# Altium project KC-1 FPGA Devboard.PrjPcb (part 1 of 2)
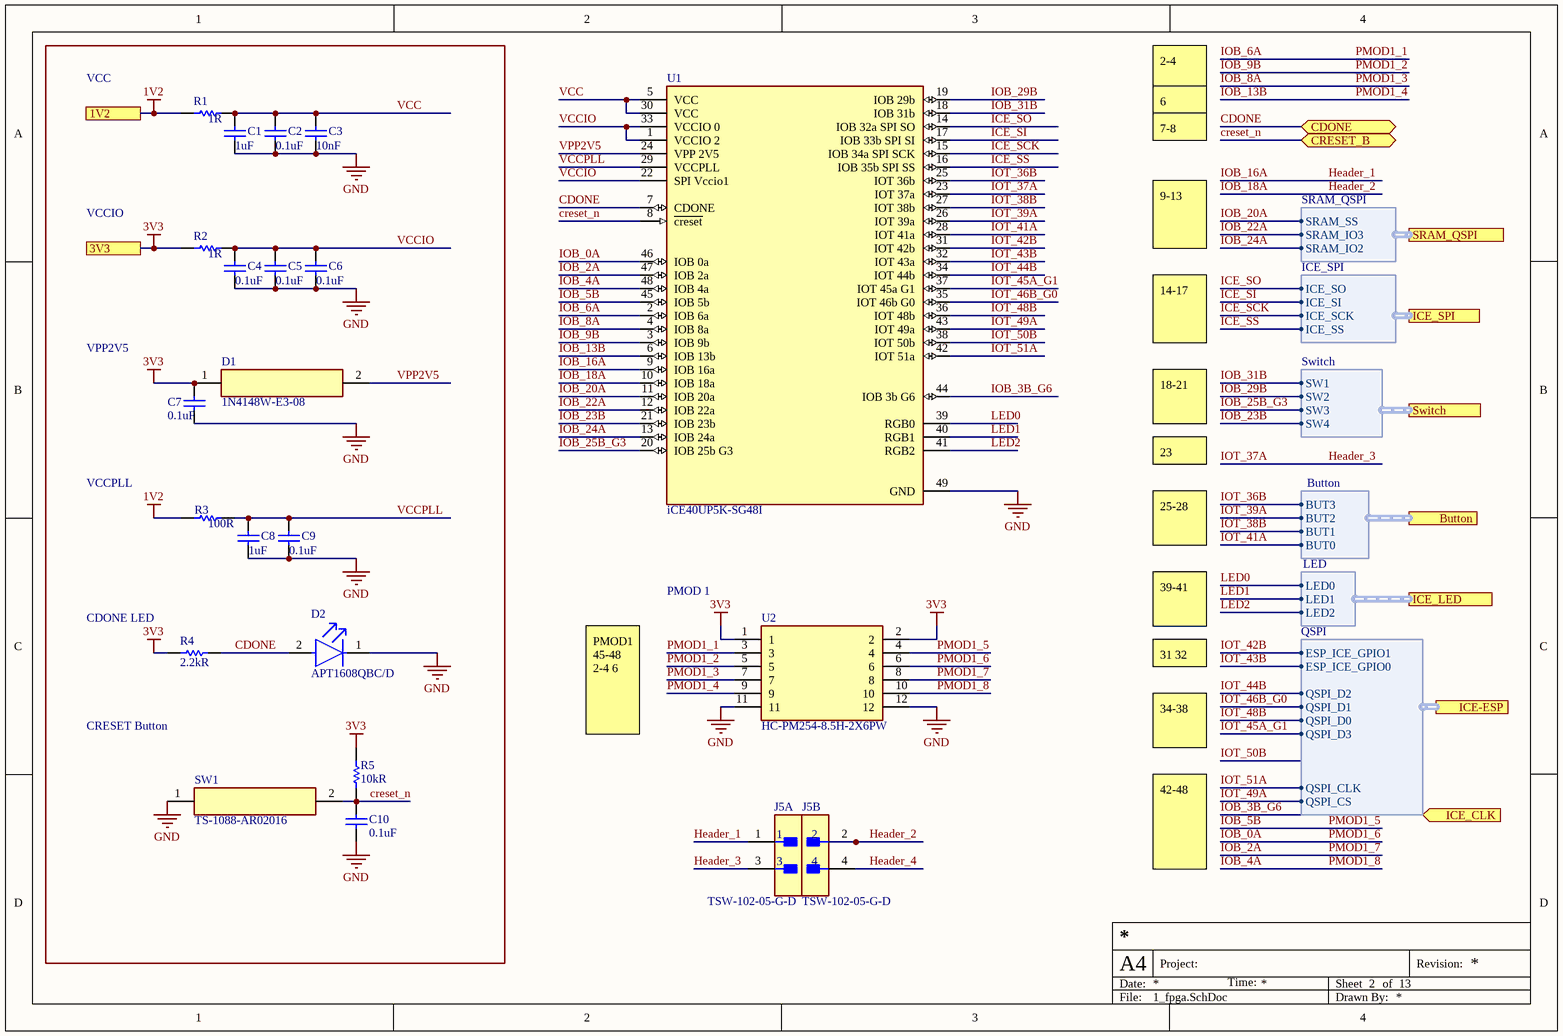
[diagram p0: 1_fpga.SchDoc]
CAGE_CODE: ?????; CONTRACT_NUMBER: <CONTRACT NO>; DOC_NO_ASSY_DWG: <ASSY DWG NO>; DOC_NO_BOM: <BOM DOC NO>; DOC_NO_FAB_DWG: <FAB DWG NO>; DOC_NO_SCH_DWG: <SCH DWG NO>; PCB_2_DEC_TOL: +/-.01; PCB_3_DEC_TOL: +/-.010; PCB_ANG_TOL: +/-1/2; PCB_ASSEMBLY_NO: <PCB ASSY NO>; PCB_CHECKER: - -----; PCB_CHECKER_APP_DATE: --/--/----; PCB_DESIGNER: - -----; PCB_DESIGNER_APP_DATE: --/--/----; PCB_DWG_NO: <PCB DWG NO>; PCB_ENGINEER: - -----; PCB_ENGINEER_APP_DATE: --/--/----; PCB_PART_NUMBER: <PCB PN>; PCB_REV: A; SCH_REV: A
12 sheets, 227 parts. Net scope: hierarchical (ports join the sheet entries above them; power ports are global).
Board file: PCB1.PcbDoc
Sheets:
  1_fpga.SchDoc
  2_power.SchDoc
  3_IO.SchDoc
  4_esp32.SchDoc
  5_FTDI.SchDoc
  6_FPGA_Flash.SchDoc
  7_SD_slot.SchDoc
  8_Lights.SchDoc
  9_ESP32_GPIO_header.SchDoc
  10_microphone.SchDoc
  12_PSRAM.SchDoc
  11_ethernet.SchDoc

## Sheet 1_fpga.SchDoc
size A4; SheetNumber: 2; SheetTotal: 13

### Parts
C1  1uF  [CAPC1609X100X15NL20]
C2  0.1uF  [CAPC1609X100X15NL20]
C3  10nF  [CAPC1609X100X15NL20]
C4  0.1uF  [CAPC1609X100X15NL20]
C5  0.1uF  [CAPC1609X100X15NL20]
C6  0.1uF  [CAPC1609X100X15NL20]
C7  0.1uF  [CAPC1609X100X15NL20]
C8  1uF  [CAPC1609X100X15NL20]
C9  0.1uF  [CAPC1609X100X15NL20]
C10  0.1uF  [CAPC1609X100X15NL20]
D1  1N4148W-E3-08  [SOD-123_L2.8-W1.8-LS3.7-RD]
D2  APT1608QBC/D  [FP-APT1608QBC-D-MFG]
J5  TSW-102-05-G-D  [FP-TSW-102-05-G-D-MFG]  (parts A,B of 2)
R1  1R  [RESC1609X55X30NL10T20]
R2  1R  [RESC1609X55X30NL10T20]
R3  100R  [RESC1609X55X30NL10T20]
R4  2.2kR  [RESC1609X55X30NL10T20]
R5  10kR  [RESC1609X55X30NL10T20]
SW1  TS-1088-AR02016  [SW-SMD_L3.9-W3.0-P4.45]
U1  iCE40UP5K-SG48I  [FP-QFN-48-IPC_C]
U2  HC-PM254-8.5H-2X6PW  [CONN-TH_HC-PM254-8.5H-2X6PW]

### Ports
1V2, 3V3, Button (harness Button), CDONE (bidir), CRESET_B (bidir), ICE-ESP (harness QSPI), ICE_CLK (in), ICE_LED (harness LED), ICE_SPI (harness ICE_SPI), SRAM_QSPI (harness SRAM_QSPI), Switch (harness Switch)

### Harnesses
Switch: SW1, SW2, SW3, SW4
Button: BUT0, BUT2, BUT3, BUT1
ICE_SPI: ICE_SO, ICE_SI, ICE_SCK, ICE_SS
SRAM_QSPI: SRAM_IO3, SRAM_IO2, SRAM_SS
QSPI: QSPI_D3, QSPI_CS, QSPI_CLK, QSPI_D1, QSPI_D2, QSPI_D0, ESP_ICE_GPIO0, ESP_ICE_GPIO1
LED: LED2, LED0, LED1

### Nets
1V2: R1.1 R3.1 ; port 1V2
3V3: C7.2 D1.1(K) R2.1 R4.2 R5.1 U2.1 U2.2 ; port 3V3
GND: C1.1 C2.1 C3.1 C4.1 C5.1 C6.1 C7.1 C8.1 C9.1 C10.2 D2.1(C) SW1.1 U1.49(GND) U2.11 U2.12
CDONE: D2.2(A) R4.1 U1.7(CDONE) ; port CDONE
creset_n: C10.1 R5.2 SW1.2 U1.8(~{creset}) ; port CRESET_B
Header_1: J5.1 U1.9(IOB_16a)  [also labelled IOB_16A]
Header_2: J5.2 U1.10(IOB_18a)  [also labelled IOB_18A]
Header_3: J5.3 U1.23(IOT_37a)  [also labelled IOT_37A]
Header_4: J5.4 U1.38(IOT_50b)  [also labelled IOT_50B]
ICE_SCK: U1.15(IOB_34a_SPI_SCK) ; port ICE_SPI.ICE_SCK
ICE_SI: U1.17(IOB_33b_SPI_SI) ; port ICE_SPI.ICE_SI
ICE_SO: U1.14(IOB_32a_SPI_SO) ; port ICE_SPI.ICE_SO
ICE_SS: U1.16(IOB_35b_SPI_SS) ; port ICE_SPI.ICE_SS
IOB_0A: U1.46(IOB_0a) U2.6  [also labelled PMOD1_6]
IOB_2A: U1.47(IOB_2a) U2.8  [also labelled PMOD1_7]
IOB_3B_G6: U1.44(IOB_3b_G6) ; port ICE_CLK
IOB_4A: U1.48(IOB_4a) U2.10  [also labelled PMOD1_8]
IOB_5B: U1.45(IOB_5b) U2.4  [also labelled PMOD1_5]
IOB_6A: U1.2(IOB_6a) U2.3  [also labelled PMOD1_1]
IOB_8A: U1.4(IOB_8a) U2.7  [also labelled PMOD1_3]
IOB_9B: U1.3(IOB_9b) U2.5  [also labelled PMOD1_2]
IOB_13B: U1.6(IOB_13b) U2.9  [also labelled PMOD1_4]
IOB_20A: U1.11(IOB_20a) ; port SRAM_QSPI.SRAM_SS
IOB_22A: U1.12(IOB_22a) ; port SRAM_QSPI.SRAM_IO3
IOB_23B: U1.21(IOB_23b) ; port Switch.SW4
IOB_24A: U1.13(IOB_24a) ; port SRAM_QSPI.SRAM_IO2
IOB_25B_G3: U1.20(IOB_25b_G3) ; port Switch.SW3
IOB_29B: U1.19(IOB_29b) ; port Switch.SW2
IOB_31B: U1.18(IOB_31b) ; port Switch.SW1
IOT_36B: U1.25(IOT_36b) ; port Button.BUT3
IOT_38B: U1.27(IOT_38b) ; port Button.BUT1
IOT_39A: U1.26(IOT_39a) ; port Button.BUT2
IOT_41A: U1.28(IOT_41a) ; port Button.BUT0
IOT_42B: U1.31(IOT_42b) ; port ICE-ESP.ESP_ICE_GPIO1
IOT_43B: U1.32(IOT_43a) ; port ICE-ESP.ESP_ICE_GPIO0
IOT_44B: U1.34(IOT_44b) ; port ICE-ESP.QSPI_D2
IOT_45A_G1: U1.37(IOT_45a_G1) ; port ICE-ESP.QSPI_D3
IOT_46B_G0: U1.35(IOT_46b_G0) ; port ICE-ESP.QSPI_D1
IOT_48B: U1.36(IOT_48b) ; port ICE-ESP.QSPI_D0
IOT_49A: U1.43(IOT_49a) ; port ICE-ESP.QSPI_CS
IOT_51A: U1.42(IOT_51a) ; port ICE-ESP.QSPI_CLK
LED0: U1.39(RGB0) ; port ICE_LED.LED0
LED1: U1.40(RGB1) ; port ICE_LED.LED1
LED2: U1.41(RGB2) ; port ICE_LED.LED2
VCC: C1.2 C2.2 C3.2 R1.2 U1.5(VCC) U1.30(VCC)
VCCIO: C4.2 C5.2 C6.2 R2.2 U1.1(VCCIO_2) U1.22(SPI_Vccio1) U1.33(VCCIO_0)
VCCPLL: C8.2 C9.2 R3.2 U1.29(VCCPLL)
VPP2V5: D1.2(A) U1.24(VPP_2V5)

### Notes on the sheet
- VCC
- 2-4
- 6
- 7-8
- VCCIO
- 9-13
- VPP2V5
- 14-17
- 18-21
- VCCPLL
- 23
- 25-28
- (near R4) CDONE LED
- PMOD 1
- 39-41
- 31 32
- CRESET Button
- PMOD1
  45-48
  2-4 6
- 34-38
- 42-48
- Date:
- A4
- Project:
- Time:
- Sheet
- of
- Revision:
- File:
- Drawn By:

### Library data of the parts
C1-C10 = CMP-2006-00183-1: Manufacturer: AVX Interconnect / Elco; Part Number: TACL105K006XTA
D1 = CMP-004-00031-1: Diode Configuration:1 Independent Pd - Power Dissipation:350mW Current - Rectified:150mA Voltage - DC Reverse(Vr):75V Voltage - Forward(Vf@If):1.2V@100mA Non-Repetitive Peak Forward Surge Current:2A Reverse Leakage Current (Ir):100uA@100V Reverse Recovery; Manufacturer: VISHAY(威世); Current - Rectified: 150mA; Reverse Recovery Time (trr): 4ns; Operating Junction Temperature Range: -55℃~+150℃; Voltage - DC Reverse(Vr): 75V; Pd - Power Dissipation: 350mW; Non-Repetitive Peak Forward Surge Current: 2A; LCSC Part Name: 75V 150mA; Manufacturer Part: 1N4148W-E3-08; Diode Configuration: 1 Independent; Supplier Footprint: SOD-123; Datasheet: https://item.szlcsc.com/datasheet/1N4148W-E3-08/240783.html; Reverse Leakage Current (Ir): 100uA@100V; Voltage - Forward(Vf@If): 1.2V@100mA; Supplier Part: C241939; Design Item ID: 1N4148W-E3-08; Source: EasyEDA.schlib; JLCPCB Part Class: Extended Part
D2 = CMP-2000-05788-2: LED BLUE CLEAR CHIP SMD; Lens Style: Flat; Forward Current: 20mA; Luminous Intensity: 100mcd; Number of LEDs: 1; Dominant Wavelength: 465nm; Lens Color: Colorless; Forward Voltage: 3.3V; Viewing Angle: 120°; Case Code (Imperial): 0603; Number of Pins: 2; Length: 1.6mm; Mount: Surface Mount; Color: Blue; Width: 0.8mm; Height: 0.75mm; Case/Package: 0603; Lead Free: Lead Free; Case Code (Metric): 1608; Lens Transparency: Clear; Min Operating Temperature: -40°C; Packaging: Tape and Reel; Max Operating Temperature: 85°C; Package Quantity: 2000; Test Current: 20mA; Illumination Color: Blue
J5 = CMP-02766-001389-1: CONN HEADER VERT 4POS 2.54MM; Max Voltage Rating (AC): 550V; Connector Type: Male Pin; Row Spacing: 0.1inch; Max Current Rating: 7.6A; Number of Positions: 4; Gender: Male; Packaging: Bulk; Color: Black; Housing Material: Plastic; Contact Material: Bronze; Contact Plating: Gold; Housing Color: Black; Width: 5.08mm; Orientation: Straight; Pitch: 2.54mm; Lead Free: Lead Free; Series: TSW; Min Operating Temperature: -55°C; Contact Type: Male Pin; Height: 2.54mm; Termination: Solder; Number of Rows: 2; Contact Mating Length: 0.105inch; Package Quantity: 1; Length: 5.08mm; REACH SVHC: No SVHC; Mount: Through Hole; Radiation Hardening: No; Number of Contacts: 4; Max Operating Temperature: 125°C
R1-R5 = CMP-2000-03692-1: Manufacturer: Vishay Dale; Part Number: TNPW060310K0BEEN
SW1 = TS-1088-AR02016: Circuit:SPST Actuator Style:Round Button Operating Force:1.6N Mounting Type:Surface Mount,Vertical Length:3.9mm Width:3mm Switch Height:2mm with Bracket:Without Bracket Contact Current:50mA Voltage Rating:12V Actuator/Cap Color:Black With Lamp:- IP Rating; Manufacturer: XUNPU(讯普); Circuit: SPST; Operating Force: 1.6N; Switch Height: 2mm; Contact Current: 50mA; Voltage Rating: 12V; Actuator/Cap Color: Black; Life: 100,000 cycles; LCSC Part Name: 3.9*3*2mm 立贴 轻触开关; Supplier Part: C720477; Manufacturer Part: TS-1088-AR02016; Supplier Footprint: SMD,4x3mm; JLCPCB Part Class: Basic Part; Datasheet: https://item.szlcsc.com/datasheet/TS-1088-AR02016/763484.html; Supplier: LCSC; Actuator Style: Round Button; Mounting Type: Surface Mount,Vertical; Length: 3.9mm; Width: 3mm; with Bracket: Without Bracket; Termination Style: SMD(SMT) Tab; Operating Temperature: -30℃~+80℃
U1 = CMP-17932-000001-1: ICE40-ULTRAPLUS, 5280 LUTS, 1.2V; Manufacturer: Lattice; Propagation Delay: 9ns; Frequency: 48MHz; Max Junction Temp: +100°C; Ram Size: 1024Kbits; Number Of Logic Elements Cells: 5280; Number Of I/Os: 39; Max Supply Voltage: 3.46V; Standoff Height: 0mm; Nominal Supply Current: 2.5-12mA; Min Supply Voltage: 1.14V; Number Of Logic Blocks: 660; Device Class L3: FPGAs - Field Programmable Gate Arrays; Temperature Range High: +100°C; Device Class L1: Integrated Circuits (ICs); Device Class L2: Embedded Processors and Controllers; Ipc Land Pattern Name: QFN50P700X700X90-48; Automotive: No; RoHS: TRUE; Lead Free: Yes; Height: 1mm; ComponentLink2Description: Datasheet; Manufacturer Part Number: iCE40UP5K-SG48I; Temperature Range Low: -40°C; Package: QFN-48; Temperature: -40°C to +100°C; Octopart: https://octopart.com/ice40up5k-sg48i-lattice+semiconductor-87369311; Footprint Url: http://www.latticesemi.com/view_document?document_id=213; Digikey Description: ICE40-ULTRAPLUS, 5280 LUTS, 1.2V; ComponentLink2URL: http://www.latticesemi.com/view_document?document_id=51968; Category: IC
U2 = HC-PM254-8.5H-2X6PW: Holes Structure:2x6P Pitch:2.54mm Row Spacing:2.54mm Circular Hole / Square Hole:Square Hole Mounting Type:Right Angle Number of Rows:2 Number of Positions:12P Current Rating:3A Voltage Rating (Max):- Holes Direction:Side Insulation Height:5mm Contact Mat; Manufacturer: HC(虹成电子); Holes Structure: 2x6P; Pitch: 2.54mm; Number of Positions: 12P; Current Rating: 3A; Holes Direction: Side; PIN Length: 3mm; LCSC Part Name: 间距2.54mm 2x6Pin 弯插 PC3.2 PB12.7 H8.5; Supplier Part: C22373932; Manufacturer Part: HC-PM254-8.5H-2x6PW; Supplier Footprint: 弯插,P=2.54mm; JLCPCB Part Class: Extended Part; Datasheet: https://item.szlcsc.com/datasheet/HC-PM254-8.5H-2x6PW/23870269.html; Supplier: LCSC; Row Spacing: 2.54mm; Circular Hole / Square Hole: Square Hole; Mounting Type: Right Angle; Number of Rows: 2; Insulation Height: 5mm; Contact Material: Brass; Contact Plating: Gold; Operating Temperature: -40℃~+105℃

## Sheet 2_power.SchDoc
size A4; SheetNumber: 3; SheetTotal: 13
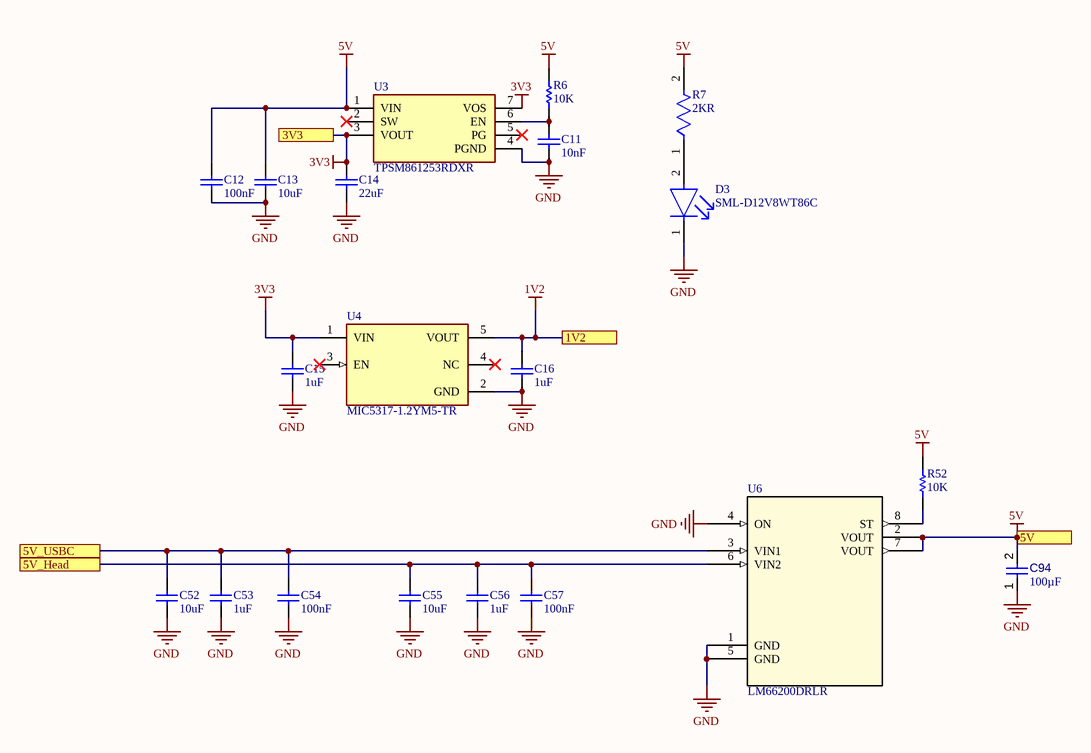
[diagram p1: 2_power.SchDoc]

### Parts
C11  10nF  [CAPC1608X90X35ML15T15]
C12  100nF  [CAPC1608X90X35ML15T15]
C13  10uF  [CAPC1608X90X35ML15T15]
C14  22uF  [CAPC1608X90X35ML15T15]
C15  1uF  [CAPC1608X90X35LL15T15]
C16  1uF  [CAPC1608X90X35LL15T15]
C52  10uF  [CAPC1608X90X35ML15T15]
C53  1uF  [CAPC1608X90X35LL15T15]
C54  100nF  [CAPC1608X90X35ML15T15]
C55  10uF  [CAPC1608X90X35ML15T15]
C56  1uF  [CAPC1608X90X35LL15T15]
C57  100nF  [CAPC1608X90X35ML15T15]
C94  value 100µF  [CAPC0805(2012)145_L]  (hidden comment: Capacitor 100µF +/-20% 6.3V 0805)
D3  SML-D12V8WT86C  [FP-SML-D12-MFG]
R6  10K  [RESC1609X55X30NL10T20]
R7  2KR  [FP-CPF0603-MFG]
R52  10K  [RESC1609X55X30NL10T20]
U3  TPSM861253RDXR  [QFN-7_L4.0-W3.3_TPSM863257RDXR]
U4  MIC5317-1.2YM5-TR  [FP-SOT23-5LD-PL-1-MFG]
U6  LM66200DRLR  [SOT-5X3_DRL_TEX]

### Ports
1V2, 3V3, 5V, 5V_Head, 5V_USBC

### Nets
1V2: C16.2 U4.5(VOUT) ; port 1V2
3V3: C14.2 C15.2 U3.3(VOUT) U3.7(VOS) U4.1(VIN) ; port 3V3
5V: C12.2 C13.2 C94.2 R6.2 R7.2 R52.2 U3.1(VIN) U6.2(VOUT) U6.7(VOUT) ; port 5V
GND: C11.1 C12.1 C13.1 C14.1 C15.1 C16.1 C52.1 C53.1 C54.1 C55.1 C56.1 C57.1 C94.1 D3.1(C) U3.4(PGND) U4.2(GND) U6.1(GND) U6.4(ON) U6.5(GND)
NetC11_2: C11.2 R6.1 U3.6(EN)
NetC52_2: C52.2 C53.2 C54.2 U6.3(VIN1) ; port 5V_USBC
NetC55_2: C55.2 C56.2 C57.2 U6.6(VIN2) ; port 5V_Head
NetD3_2: D3.2(A) R7.1
NetR52_1: R52.1 U6.8(ST)

Not connected (* = marked no-connect by the designer): U3 2(SW)* 5(PG)*; U4 3(EN)* 4(NC)*

### Notes on the sheet
- Date:
- A4
- Project:
- Time:
- Sheet
- of
- Revision:
- File:
- Drawn By:

### Library data of the parts
C11-C14 C52 C54 C55 C57 = CMP-2006-04205-1: Manufacturer: AVX Interconnect / Elco; Part Number: 06034D226MAT2A
C15 C16 C53 C56 = CMP-2006-02241-1: Part Number: C0603C105K9PACTU; Manufacturer: Kemet
C94 = CMP-001-00054-4: Chip Capacitor, 100µF +/-20%, 6.3V, 0805, Thickness 1.45 mm; Tolerance: 10%; Min Operating Temperature: -55°C; Max Operating Temperature: 85°C; Pins: 2; Mounting Technology: SMT; Case/Package: 0805; Voltage Rating: 6.3V
D3 = CMP-08952-000027-1: LED RED 1608 SMD; Forward Voltage: 2.2V; Luminous Intensity: 40mcd; Lens Size: 0.8mm; Lens Style: Flat; Lens Color: White; Test Current: 20mA; Dominant Wavelength: 630nm; Height: 0.65mm; Length: 1.6mm; Case Code (Metric): 1608; Color: Red; Mount: Surface Mount; Width: 0.8mm; Case Code (Imperial): 0603; Case/Package: 0603; Packaging: Tape and Reel
R6 R52 = CMP-2000-03692-1: as R1 on sheet 1_fpga
R7 = CMP-03211-009149-1: RES SMD 2.0KΩ 1% 1/16W 0603; Manufacturer: TE Connectivity; Manufacturer Part Number: CPF0603F2K0C1; Power Rating: 0.063W; Temperature Coefficient: 50ppm/°C; Voltage Rating: 50V; Temperature Range High: +155°C; Category: Res; Octopart: https://octopart.com/cpf0603f2k0c1-te+connectivity-7514873; ComponentLink2URL: https://www.te.com/commerce/DocumentDelivery/DDEController?Action=showdoc&DocId=Data+Sheet%7F1773200%7FM%7Fpdf%7FEnglish%7FENG_DS_1773200_M.pdf%7F3-1676481-2; Device Class L3: Chip SMD Resistors; Temperature Range Low: -55°C; Automotive: No; Lead Free: Yes; Device Class L2: Resistors; Device Class L1: Passive Components; Resistance: 2.0KΩ; octopart_url: https://octopart.com/cpf0603f2k0c1-te+connectivity-7514873; packaging: 1k Reel; Composition: Thin Film; ComponentLink2Description: Datasheet; Temperature: -55°C to +155°C; Package: CPF0603; RoHS: TRUE; Ipc Land Pattern Name: RESC15580X45; Tolerance: 1%; Value: 2.0KΩ; Height: 0.55mm; Series: CPF
U3 = TPSM861253RDXR: Function:Step-down type Number of Outputs:1 Voltage - Supply:3V~17V Voltage - Supply:3V~17V Conversion Efficiency:- Conversion Efficiency:- Output Voltage:3.3V Output Voltage:3.3V Output Voltage Accuracy:±1% Output Voltage Accuracy:±1% Output Current(Max); Manufacturer: TI(德州仪器); Number of Outputs: 1; Voltage - Supply: 3V~17V; Output Voltage: 3.3V; Output Voltage Accuracy: ±1%; Output Current(Max): 1A; Quiescent Supply Current: 370uA; Ripple Noise: 20mVp-p; Switching Frequency: 1.4MHz; LCSC Part Name: 3V至17V输入、1A同步降压模块; Supplier Part: C31183817; Manufacturer Part: TPSM861253RDXR; Supplier Footprint: QFN-FCMOD-7(3.3x4); JLCPCB Part Class: Extended Part; Datasheet: https://www.ti.com.cn/cn/lit/ds/symlink/tpsm861252.pdf?ts=1729502160167&ref_url=https%253A%252F%252Fwww.ti.com.cn%252Fsitesearch%252Fzh-cn%252Fdocs%252Funiversalsearch.tsp%253FlangPref%253Dzh-CN%2526nr%253D9%2526searchTerm%253DTPSM861252RDXR; Supplier: LCSC; Function: Step-down type; Operating Temperature Range: -40℃~+125℃; Length: 4mm; Width: 3.3mm; Height: 2mm; Features: Overvoltage protection；Over-temperature protection；Over Current Protection；Under Voltage Protection；Automatic fault recovery
U4 = CMP-00252-66802792-1: MIC5317-1.8YM5-TR LDO Regulator Pos 1.8V 0.15A 5-Pin SOT-23 T/R; Number of Outputs: 1; Dropout Voltage: 155mV; Power Supply Rejection Ratio (PSRR): 70dB; Max Input Voltage: 6V; Min Input Voltage: 2.5V; Output Current: 150mA; Min Current Limit: 200mA; Schedule B: 8542390000, 8542390000; Min Operating Temperature: -40°C; Lifecycle Status: Production; NexarPartId: 66802792; Mount: Surface Mount; Output Voltage: 1.8V; Number of Regulators: 1; RoHS: Compliant; Case/Package: SOT-23-5; Max Operating Temperature: 125°C
U6 = CMP-005-000000-1: 1.6-V to 5.5-V, 40-mâ„; Manufacturer_Name: Texas Instruments; Manufacturer_Part_Number: LM66200DRLR; Pin Count: 8; Source: LM66200DRLR.SchLib; Type: Type; Component Type: Standard; Design Item ID: LM66200DRLR; Copyright: Copyright (C) 2025 Ultra Librarian. All rights reserved.; RefDes: RefDes

## Sheet 3_IO.SchDoc
size A3; SheetNumber: 4; SheetTotal: 13
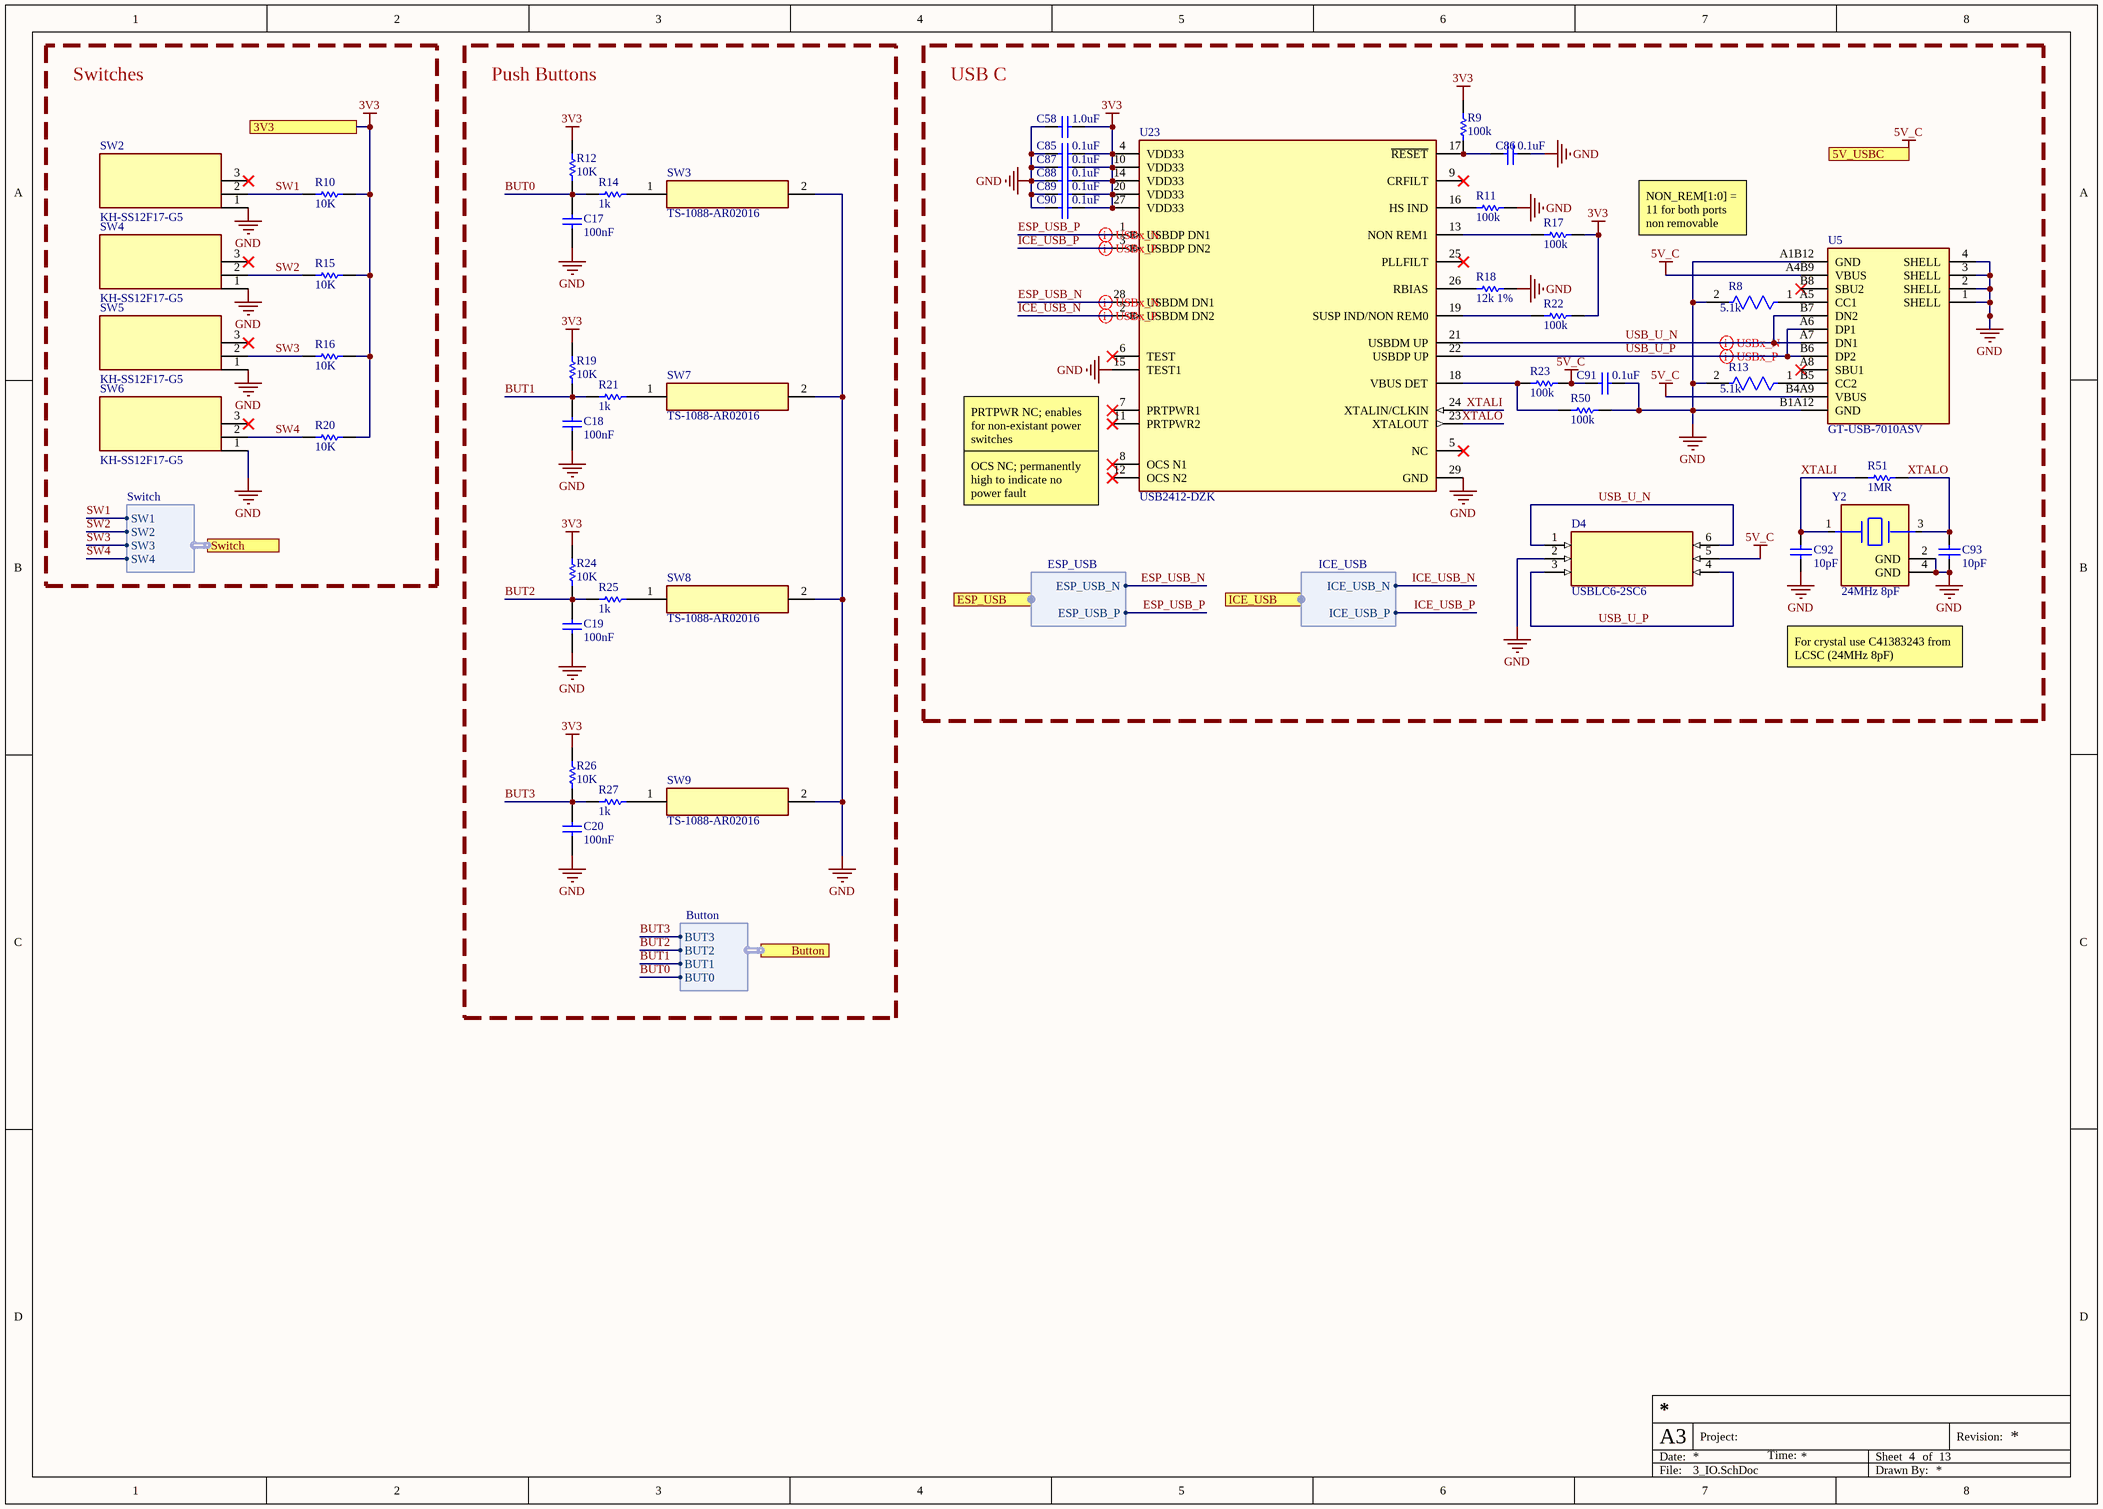
[diagram p2: 3_IO.SchDoc]

### Parts
C17  value 100nF  [CAP0603R]  (hidden comment: EMF107B7104KAHT)
C18  value 100nF  [CAP0603R]  (hidden comment: EMF107B7104KAHT)
C19  value 100nF  [CAP0603R]  (hidden comment: EMF107B7104KAHT)
C20  value 100nF  [CAP0603R]  (hidden comment: EMF107B7104KAHT)
C58  1.0uF  [CAPC1608X90X35ML15T15]
C85  0.1uF  [CAPC1608X90X35ML15T15]
C86  0.1uF  [CAPC1608X90X35ML15T15]
C87  0.1uF  [CAPC1608X90X35ML15T15]
C88  0.1uF  [CAPC1608X90X35ML15T15]
C89  0.1uF  [CAPC1608X90X35ML15T15]
C90  0.1uF  [CAPC1608X90X35ML15T15]
C91  0.1uF  [CAPC1608X90X35ML15T15]
C92  10pF  [CAPC1608X90X35ML15T15]
C93  10pF  [CAPC1608X90X35ML15T15]
D4  USBLC6-2SC6  [SOT-23-6_L2.9-W1.6-P0.95-LS2.8-BL]
R8  5.1k  [FP-MCT0603-IPC_B]
R9  100k  [RESC1609X55X30NL10T20]
R10  10K  [RESC1609X55X30NL10T20]
R11  100k  [RESC1609X55X30NL10T20]
R12  10K  [RESC1609X55X30NL10T20]
R13  5.1k  [FP-MCT0603-IPC_B]
R14  1k  [RESC1609X55X30NL10T20]
R15  10K  [RESC1609X55X30NL10T20]
R16  10K  [RESC1609X55X30NL10T20]
R17  100k  [RESC1609X55X30NL10T20]
R18  12k 1%  [RESC1609X55X30NL10T20]
R19  10K  [RESC1609X55X30NL10T20]
R20  10K  [RESC1609X55X30NL10T20]
R21  1k  [RESC1609X55X30NL10T20]
R22  100k  [RESC1609X55X30NL10T20]
R23  100k  [RESC1609X55X30NL10T20]
R24  10K  [RESC1609X55X30NL10T20]
R25  1k  [RESC1609X55X30NL10T20]
R26  10K  [RESC1609X55X30NL10T20]
R27  1k  [RESC1609X55X30NL10T20]
R50  100k  [RESC1609X55X30NL10T20]
R51  1MR  [RESC1609X55X30NL10T20]
SW2  KH-SS12F17-G5  [SW-TH_KH-SS12F17-G5]
SW3  TS-1088-AR02016  [SW-SMD_L3.9-W3.0-P4.45]
SW4  KH-SS12F17-G5  [SW-TH_KH-SS12F17-G5]
SW5  KH-SS12F17-G5  [SW-TH_KH-SS12F17-G5]
SW6  KH-SS12F17-G5  [SW-TH_KH-SS12F17-G5]
SW7  TS-1088-AR02016  [SW-SMD_L3.9-W3.0-P4.45]
SW8  TS-1088-AR02016  [SW-SMD_L3.9-W3.0-P4.45]
SW9  TS-1088-AR02016  [SW-SMD_L3.9-W3.0-P4.45]
U5  GT-USB-7010ASV  [USB-C-SMD_G-SWITCH_GT-USB-7010ASV]
U23  USB2412-DZK  [FP-USB2412-DZK-MFG]
Y2  24MHz 8pF  [FP-TSX-3225-MFG]

### Blocks framed on the sheet
Switches: R10 R15 R16 R20 SW2 SW4-SW6
Push Buttons: C17-C20 R12 R14 R19 R21 R24-R27 SW3 SW7-SW9
USB C: C58 C85-C93 D4 R8 R9 R11 R13 R17 R18 R22 R23 R50 R51 U5 U23 Y2

### Ports
3V3, 5V_USBC, Button (harness Button), ESP_USB (harness ESP_USB), ICE_USB (harness ICE_USB), Switch (harness Switch)

### Harnesses
Switch: SW1, SW2, SW3, SW4
Button: BUT0, BUT2, BUT3, BUT1
ICE_USB: ICE_USB_N, ICE_USB_P
ESP_USB: ESP_USB_N, ESP_USB_P

### Nets
3V3: C58.1 C85.1 C87.1 C88.1 C89.1 C90.1 R9.2 R10.1 R12.2 R15.1 R16.1 R17.1 R19.2 R20.1 R22.1 R24.2 R26.2 U23.4(VDD33) U23.10(VDD33) U23.14(VDD33) U23.20(VDD33) U23.27(VDD33) ; port 3V3
5V_C: C91.2 D4.5 R23.1 U5.A4B9(VBUS) U5.B4A9(VBUS) ; port 5V_USBC
GND: C17.1 C18.1 C19.1 C20.1 C58.2 C85.2 C86.1 C87.2 C88.2 C89.2 C90.2 C91.1 C92.2 C93.2 D4.2 R8.2 R11.1 R13.2 R18.1 R50.1 SW2.1 SW3.2 SW4.1 SW5.1 SW6.1 SW7.2 SW8.2 SW9.2 U5.1(SHELL) U5.2(SHELL) U5.3(SHELL) U5.4(SHELL) U5.A1B12(GND) U5.B1A12(GND) U23.15(TEST1) U23.29(GND) Y2.2(GND) Y2.4(GND)
BUT0: C17.2 R12.1 R14.2 ; port Button.BUT0
BUT1: C18.2 R19.1 R21.2 ; port Button.BUT1
BUT2: C19.2 R24.1 R25.2 ; port Button.BUT2
BUT3: C20.2 R26.1 R27.2 ; port Button.BUT3
ESP_USB_N: U23.28(USBDM_DN1) ; port ESP_USB.ESP_USB_N
ESP_USB_P: U23.1(USBDP_DN1) ; port ESP_USB.ESP_USB_P
ICE_USB_N: U23.2(USBDM_DN2) ; port ICE_USB.ICE_USB_N
ICE_USB_P: U23.3(USBDP_DN2) ; port ICE_USB.ICE_USB_P
SW1: R10.2 SW2.2 ; port Switch.SW1
SW2: R15.2 SW4.2 ; port Switch.SW2
SW3: R16.2 SW5.2 ; port Switch.SW3
SW4: R20.2 SW6.2 ; port Switch.SW4
USB_U_N: D4.1 D4.6 U5.A7(DN1) U5.B7(DN2) U23.21(USBDM_UP)
USB_U_P: D4.3 D4.4 U5.A6(DP1) U5.B6(DP2) U23.22(USBDP_UP)
XTALI: C92.1 R51.2 U23.24(XTALIN/CLKIN) Y2.1
XTALO: C93.1 R51.1 U23.23(XTALOUT) Y2.3
NetC86_2: C86.2 R9.1 U23.17(~{RESET})
NetR8_1: R8.1 U5.A5(CC1)
NetR11_2: R11.2 U23.16(HS_IND)
NetR13_1: R13.1 U5.B5(CC2)
NetR14_1: R14.1 SW3.1
NetR17_2: R17.2 U23.13(NON_REM1)
NetR18_2: R18.2 U23.26(RBIAS)
NetR21_1: R21.1 SW7.1
NetR22_2: R22.2 U23.19(SUSP_IND/NON_REM0)
NetR23_2: R23.2 R50.2 U23.18(VBUS_DET)
NetR25_1: R25.1 SW8.1
NetR27_1: R27.1 SW9.1

Not connected (* = marked no-connect by the designer): SW2 3*; SW4 3*; SW5 3*; SW6 3*; U5 A8(SBU1)* B8(SBU2)*; U23 5(NC)* 6(TEST)* 7(PRTPWR1)* 8(OCS_N1)* 9(CRFILT)* 11(PRTPWR2)* 12(OCS_N2)* 25(PLLFILT)*

### Layout directives
differential pair: ESP_USB_N, ESP_USB_P, ICE_USB_N, ICE_USB_P, USB_U_N, USB_U_P

### Notes on the sheet
- NON_REM[1:0] = 11 for both ports non removable
- (near U23) PRTPWR NC; enables for non-existant power switches
- (near U23) OCS NC; permanently high to indicate no power fault
- For crystal use C41383243 from LCSC (24MHz 8pF)
- Date:
- A3
- Project:
- Time:
- Sheet
- of
- Revision:
- File:
- Drawn By:

### Library data of the parts
C17-C20 = CMP-024-000573-8: CAP, MLCC, 0603/1608, 16V, X7R,; Manufacturer: Taiyo Yuden; Tolerance: 10%; Case/Package: 0603 (1608 Metric); Supplier 1: Digi-Key; Max Operating Temperature: 125°C; PN: EMF107B7104KAHT; Temperature Coefficient: X7R; ComponentLink1URL: https://ds.yuden.co.jp/TYCOMPAS/ut/detail?pn=EMF107B7104KAHT&u=M; Min Operating Temperature: -55°C; ComponentLink1Description: Datasheet; Supplier Part Number 1: 587-6558-1-ND; Rating: AEC-Q200
C58 C85-C93 = CMP-2006-04205-1: as C11 on sheet 2_power
D4 = USBLC6-2SC6: Polarity:Unidirectional Reverse Stand-Off Voltage (Vrwm):5.25V Clamping Voltage:17V Peak Pulse Current (Ipp):5A Voltage - Breakdown:6V Reverse Leakage Current (Ir):150nA Number of Channels:2 Operating Temperature:-40℃~+125℃ Operating Temperature:-40℃~+125; Manufacturer: ST(意法半导体); Reverse Stand-Off Voltage (Vrwm): 5.25V; Clamping Voltage: 17V; Peak Pulse Current (Ipp): 5A; Voltage - Breakdown: 6V; Reverse Leakage Current (Ir): 150nA; Number of Channels: 2; level of protection: IEC 61000-4-2; Type: ESD; Junction Capacitance: 3.5pF; LCSC Part Name: 单向ESD; Supplier Part: C7519; Manufacturer Part: USBLC6-2SC6; Supplier Footprint: SOT-23-6L; JLCPCB Part Class: Extended Part; Datasheet: https://item.szlcsc.com/datasheet/USBLC6-2SC6/7996.html; Supplier: LCSC; Polarity: Unidirectional; Operating Temperature: -40℃~+125℃
R8 R13 = CMP-02407-010205-1: RES SMD 100 OHM 1% 1/8W 0603; Resistance: 5.1kR; Tolerance: 0.1%; Temperature Coefficient: 25ppm/°C; Max Operating Temperature: 125°C; Radiation Hardening: No; Composition: Thin Film; Height: 450um; Lead Free: Lead Free; Contact Plating: Tin; Length: 1.55mm; Width: 850um; Case/Package: 0603; Min Operating Temperature: -55°C
R9-R12 R14-R27 R50 R51 = CMP-2000-03692-1: as R1 on sheet 1_fpga
SW2 SW4-SW6 = CMP-011-00014-1: Manufacturer: kinghelm(金航标); JLCPCB Part Class: Extended Part; Supplier Part: C5274464; LCSC Part Name: 拨动开关 KH-SS12F17-G5; Design Item ID: KH-SS12F17-G5; Manufacturer Part: KH-SS12F17-G5; Datasheet: https://atta.szlcsc.com/upload/public/pdf/source/20221118/A394A3D39A10FBA52FA26B90A9AAE8C2.pdf; Supplier Footprint: 插件; Source: EasyEDA.schlib
SW3 SW7-SW9 = TS-1088-AR02016: as SW1 on sheet 1_fpga; LCSC Part Name: 3.9*3*2mm 立贴 轻触开关; Supplier Part: C720477; Manufacturer Part: TS-1088-AR02016; Supplier Footprint: SMD,4x3mm; JLCPCB Part Class: Basic Part; Datasheet: https://item.szlcsc.com/datasheet/TS-1088-AR02016/763484.html; Supplier: LCSC; Actuator Style: Round Button; Mounting Type: Surface Mount,Vertical; Length: 3.9mm; Width: 3mm; with Bracket: Without Bracket; Termination Style: SMD(SMT) Tab; Operating Temperature: -30℃~+80℃
U5 = CMP-019-000005-1: Connector Type:Type-C Protocol Standard:USB 2.0 Gender:Female Mounting Type:Surface Mount, Right Angle Number of Contacts:16P Number of Ports:1 Current Rating-Power:3A Voltage Rating:24V Connect-Disconnect Life:10,000 cycles Center Height:1.68mm Length:7.; Manufacturer: G-Switch(品赞); Gender: Female; Current Rating-Power: 3A; Detection color: Black; Connector Type: Type-C; Center Height: 1.68mm; Number of Contacts: 16P; Protocol Standard: USB 2.0; Voltage Rating: 24V; Number of Ports: 1; Supplier Part: C2988369; LCSC Part Name: Type-C 母 卧贴; Datasheet: https://item.szlcsc.com/datasheet/GT-USB-7010ASV/3445595.html; Manufacturer Part: GT-USB-7010ASV; JLCPCB Part Class: Extended Part; Supplier Footprint: SMD; Source: EasyEDA.schlib; Mounting Type: Surface Mount, Right Angle; Design Item ID: GT-USB-7010ASV; Connect-Disconnect Life: 10,000 cycles; Length: 7.35mm; Operating Temperature: -40℃~+85℃
U23 = CMP-06284-000049-1: IC USB 2.0 HS HUB CTRLR 28QFN; Number of Transceivers: 1; Data Rate: 480Mbps; Number of Ports: 2; ESD Protection: Yes; Operating Supply Voltage: 3.3V; Max Supply Voltage: 3.6V; Min Supply Voltage: 3V; Min Operating Temperature: 0°C; Packaging: Tray; Lead Free: Lead Free; Interface: USB; REACH SVHC: No SVHC; Length: 5.1mm; Series: -; Case/Package: QFN; Width: 5.1mm; Number of Pins: 28; Mount: Surface Mount; Package Quantity: 490; Height: 0.95mm; Radiation Hardening: No; Max Operating Temperature: 70°C
Y2 = CMP-36405-000018-1: CRYSTAL 24.0000MHZ 9PF SMD; ESR (Equivalent Series Resistance): 40R; Frequency Stability: 20ppm; Tolerance: 10ppm; Drive Level: 200uW; Min Operating Temperature: -40°C; RoHS Compliant: Yes; Width: 2.5mm; Max Operating Temperature: 105°C; Package Quantity: 250; Load Capacitance: 9pF; Mount: Surface Mount; Lead Free: Lead Free; Height: 0.024inch; Depth: 2.5mm; Frequency: 24MHz; Packaging: Tape and Reel; Series: TSX-3225; Weight: 0.000564oz; Number of Pins: 4; Termination: SMD/SMT; Case/Package: SMD/SMT; Length: 3.2mm; Frequency Tolerance: 10ppm

## Sheet 4_esp32.SchDoc
size A4; SheetNumber: 5; SheetTotal: 13
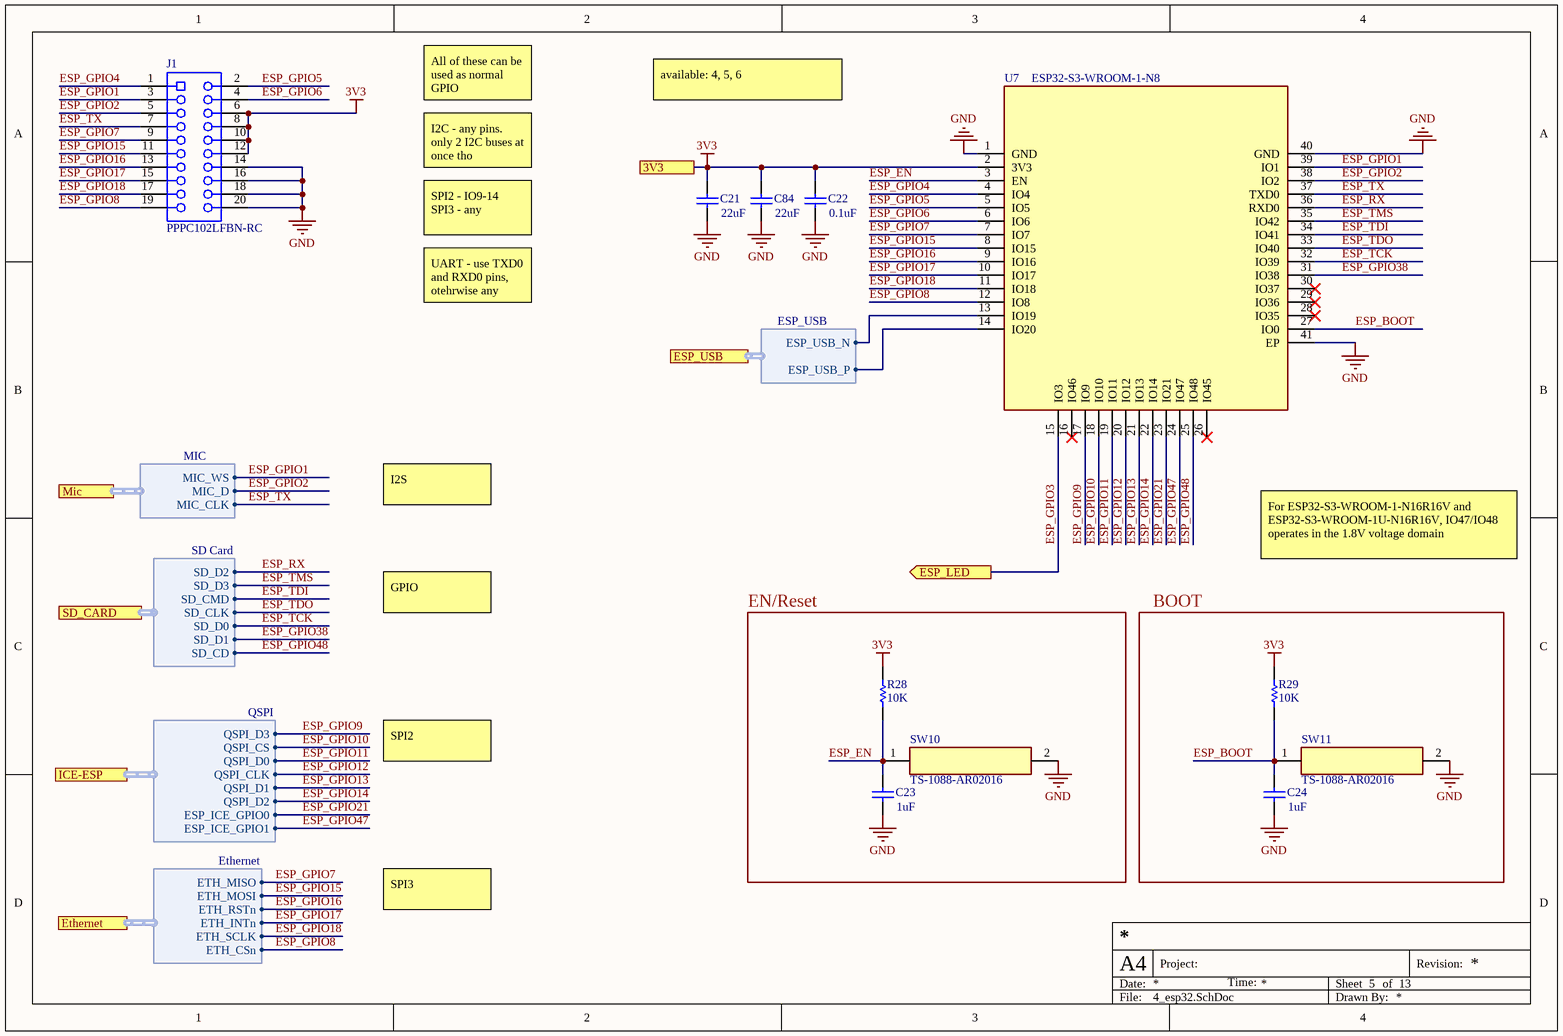
[diagram p3: 4_esp32.SchDoc]

### Parts
C21  22uF  [CAPC1609X100X15NL20]
C22  0.1uF  [CAPC1609X100X15NL20]
C23  1uF  [CAPC1609X100X15NL20]
C24  1uF  [CAPC1609X100X15NL20]
C84  22uF  [CAPC1609X100X15NL20]
J1  PPPC102LFBN-RC  [SLIN-PPPC102LFBN-RC_V]
R28  10K  [RESC1609X55X30NL10T20]
R29  10K  [RESC1609X55X30NL10T20]
SW10  TS-1088-AR02016  [SW-SMD_L3.9-W3.0-P4.45]
SW11  TS-1088-AR02016  [SW-SMD_L3.9-W3.0-P4.45]
U7  ESP32-S3-WROOM-1-N8  [WIFIM-SMD_ESP32-S3-WROOM-1-N8]

### Blocks framed on the sheet
EN/Reset: C23 R28 SW10
BOOT: C24 R29 SW11

### Ports
3V3, ESP_LED (out), ESP_USB (harness ESP_USB), Ethernet (harness Ethernet), ICE-ESP (harness QSPI), Mic (harness MIC), SD_CARD (harness SD Card)

### Harnesses
QSPI: QSPI_D3, QSPI_CS, QSPI_CLK, QSPI_D1, QSPI_D2, QSPI_D0, ESP_ICE_GPIO0, ESP_ICE_GPIO1
ESP_USB: ESP_USB_N, ESP_USB_P
Ethernet: ETH_MISO, ETH_MOSI, ETH_INTn, ETH_CSn, ETH_SCLK, ETH_RSTn
SD Card: SD_D2, SD_D3, SD_CMD, SD_CLK, SD_D0, SD_D1, SD_CD
MIC: MIC_WS, MIC_D, MIC_CLK

### Nets
3V3: C21.2 C22.2 C84.2 J1.6 J1.8 J1.10 J1.12 R28.2 R29.2 U7.2(3V3) ; port 3V3
GND: C21.1 C22.1 C23.1 C24.1 C84.1 J1.14 J1.16 J1.18 J1.20 SW10.2 SW11.2 U7.1(GND) U7.40(GND) U7.41(EP)
\: U7.32(IO39) ; port SD_CARD.SD_D0  [also labelled ESP_TCK]
ESP_BOOT: C24.2 R29.1 SW11.1 U7.27(IO0)
ESP_EN: C23.2 R28.1 SW10.1 U7.3(EN)
ESP_GPIO1: J1.3 U7.39(IO1) ; port Mic.MIC_WS
ESP_GPIO2: J1.5 U7.38(IO2) ; port Mic.MIC_D
ESP_GPIO3: U7.15(IO3) ; port ESP_LED
ESP_GPIO4: J1.1 U7.4(IO4)
ESP_GPIO5: J1.2 U7.5(IO5)
ESP_GPIO6: J1.4 U7.6(IO6)
ESP_GPIO7: J1.9 U7.7(IO7) ; port Ethernet.ETH_MISO
ESP_GPIO8: J1.19 U7.12(IO8) ; port Ethernet.ETH_CSn
ESP_GPIO9: U7.17(IO9) ; port ICE-ESP.QSPI_D3
ESP_GPIO10: U7.18(IO10) ; port ICE-ESP.QSPI_CS
ESP_GPIO11: U7.19(IO11) ; port ICE-ESP.QSPI_D0
ESP_GPIO12: U7.20(IO12) ; port ICE-ESP.QSPI_CLK
ESP_GPIO13: U7.21(IO13) ; port ICE-ESP.QSPI_D1
ESP_GPIO14: U7.22(IO14) ; port ICE-ESP.QSPI_D2
ESP_GPIO15: J1.11 U7.8(IO15) ; port Ethernet.ETH_MOSI
ESP_GPIO16: J1.13 U7.9(IO16) ; port Ethernet.ETH_RSTn
ESP_GPIO17: J1.15 U7.10(IO17) ; port Ethernet.ETH_INTn
ESP_GPIO18: J1.17 U7.11(IO18) ; port Ethernet.ETH_SCLK
ESP_GPIO21: U7.23(IO21) ; port ICE-ESP.ESP_ICE_GPIO0
ESP_GPIO38: U7.31(IO38) ; port SD_CARD.SD_D1
ESP_GPIO47: U7.24(IO47) ; port ICE-ESP.ESP_ICE_GPIO1
ESP_GPIO48: U7.25(IO48) ; port SD_CARD.SD_CD
ESP_RX: U7.36(RXD0) ; port SD_CARD.SD_D2
ESP_TDI: U7.34(IO41) ; port SD_CARD.SD_CMD
ESP_TDO: U7.33(IO40) ; port SD_CARD.SD_CLK
ESP_TMS: U7.35(IO42) ; port SD_CARD.SD_D3
ESP_TX: J1.7 U7.37(TXD0) ; port Mic.MIC_CLK
NetU7_13: U7.13(IO19) ; port ESP_USB.ESP_USB_N
NetU7_14: U7.14(IO20) ; port ESP_USB.ESP_USB_P

Not connected (* = marked no-connect by the designer): U7 16(IO46)* 26(IO45)* 28(IO35)* 29(IO36)* 30(IO37)*

### Notes on the sheet
- All of these can be used as normal GPIO
- available: 4, 5, 6
- I2C - any pins. only 2 I2C buses at once tho
- SPI2 - IO9-14
  SPI3 - any
- UART - use TXD0 and RXD0 pins, otehrwise any
- I2S
- For ESP32-S3-WROOM-1-N16R16V and ESP32-S3-WROOM-1U-N16R16V, IO47/IO48 operates in the 1.8V voltage domain
- GPIO
- SPI2
- SPI3
- Date:
- A4
- Project:
- Time:
- Sheet
- of
- Revision:
- File:
- Drawn By:

### Library data of the parts
C21-C24 C84 = CMP-2006-00183-1: as C1 on sheet 1_fpga
J1 = CMP-002-00029-2: Female Header, Pitch 2.54 mm, 2 x 10 Position, Height 8.75 mm, Tail Length 3.2 mm, -40 to 105 degC, RoHS, Bulk; Manufacturer: Sullins; Mounting Technology: TH; RoHS Compliant: Unknown; Gender: Female; Case/Package: PPPC102LFBN-RC; Min Operating Temperature: -40°C; Datasheet Version: Rev. D, 10/2007; Max Operating Temperature: 105°C; Package Description: Female Header, Pitch 2.54 mm, 2 x 10 Position, Height 8.75 mm, Tail Length 3.2 mm; Package Reference: PPPC102LFBN-RC; Connector Type: Header; Datasheet URL: http://datasheet.octopart.com/PPPC102LFBN-RC-Sullins-datasheet-8327184.pdf
R28 R29 = CMP-2000-03692-1: as R1 on sheet 1_fpga
SW10 SW11 = TS-1088-AR02016: as SW1 on sheet 1_fpga; LCSC Part Name: 3.9*3*2mm 立贴 轻触开关; Supplier Part: C720477; Manufacturer Part: TS-1088-AR02016; Supplier Footprint: SMD,4x3mm; JLCPCB Part Class: Basic Part; Datasheet: https://item.szlcsc.com/datasheet/TS-1088-AR02016/763484.html; Supplier: LCSC; Actuator Style: Round Button; Mounting Type: Surface Mount,Vertical; Length: 3.9mm; Width: 3mm; with Bracket: Without Bracket; Termination Style: SMD(SMT) Tab; Operating Temperature: -30℃~+80℃
U7 = CMP-031-00007-1: Utilized IC / Part:ESP32-S3 Chip Wireless Standard:Bluetooth5.0 Interface Type:SPI；I2S；USB；I2C；UART Frequency:2.4GHz Antenna Type:On-board PCB Antenna Output Power:20.5dBm Output Power:20.5dBm Voltage - Supply:3V~3.6V Voltage - Supply:3V~3.6V Receive  Cur; Manufacturer: ESPRESSIF(乐鑫); Send  Current: 355mA; Receive  Current: 95mA; Sensitivity: -98.2dBm; Value: 2.4GHz; Supplier Footprint: SMD,25.5x18mm; LCSC Part Name: 不带固件 通用型Wi-Fi+低功耗蓝牙MCU模组; Interface Type: SPI；I2S；USB；I2C；UART; Antenna Type: On-board PCB Antenna; Design Item ID: ESP32-S3-WROOM-1-N8; Wireless Standard: Bluetooth5.0; Source: EasyEDA.schlib; Datasheet: https://item.szlcsc.com/datasheet/ESP32-S3-WROOM-1-N8/3198296.html; Manufacturer Part: ESP32-S3-WROOM-1-N8; Utilized IC / Part: ESP32-S3 Chip; Supplier Part: C2913198; Output Power: 20.5dBm; JLCPCB Part Class: Extended Part; Operating Temperature: -40℃~+85℃; Voltage - Supply: 3V~3.6V

## Sheet 5_FTDI.SchDoc
size A4; SheetNumber: 6; SheetTotal: 13
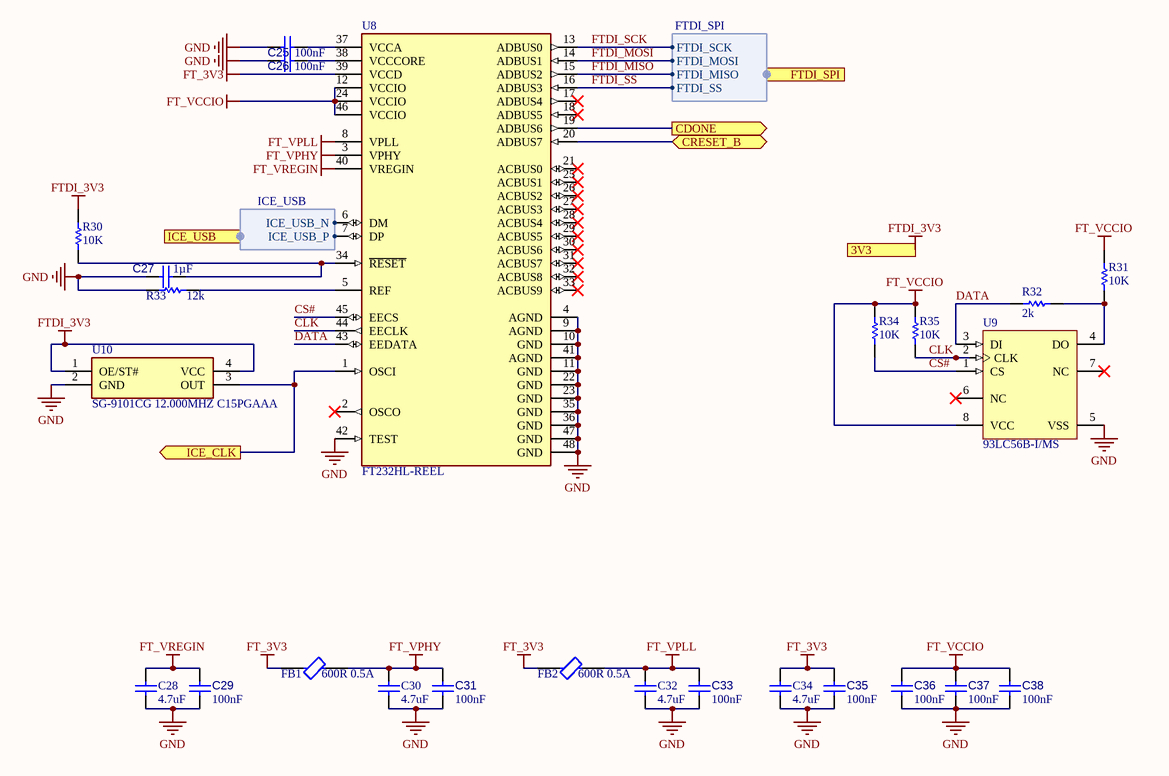
[diagram p4: 5_FTDI.SchDoc]

### Parts
C25  value 100nF  [CAPC1608X90X40NL10T20]  (hidden comment: Capacitor 100 nF +/-10% 50 V 0603)
C26  value 100nF  [CAPC1608X90X40NL10T20]  (hidden comment: Capacitor 100 nF +/-10% 50 V 0603)
C27  value 1µF  [CAPC1608X90X35ML15T15]  (hidden comment: Capacitor 1uF +/- 10% 16V 0603)
C28  4.7uF  [CAPC1608X90X35ML15T15]
C29  value 100nF  [CAPC1608X90X40NL10T20]  (hidden comment: Capacitor 100 nF +/-10% 50 V 0603)
C30  4.7uF  [CAPC1608X90X35ML15T15]
C31  value 100nF  [CAPC1608X90X40NL10T20]  (hidden comment: Capacitor 100 nF +/-10% 50 V 0603)
C32  4.7uF  [CAPC1608X90X35ML15T15]
C33  value 100nF  [CAPC1608X90X40NL10T20]  (hidden comment: Capacitor 100 nF +/-10% 50 V 0603)
C34  4.7uF  [CAPC1608X90X35ML15T15]
C35  value 100nF  [CAPC1608X90X40NL10T20]  (hidden comment: Capacitor 100 nF +/-10% 50 V 0603)
C36  value 100nF  [CAPC1608X90X40NL10T20]  (hidden comment: Capacitor 100 nF +/-10% 50 V 0603)
C37  value 100nF  [CAPC1608X90X40NL10T20]  (hidden comment: Capacitor 100 nF +/-10% 50 V 0603)
C38  value 100nF  [CAPC1608X90X40NL10T20]  (hidden comment: Capacitor 100 nF +/-10% 50 V 0603)
FB1  600R 0.5A  [FP-MMZ1608-0_8-IPC_A]
FB2  600R 0.5A  [FP-MMZ1608-0_8-IPC_A]
R30  10K  [RESC1609X55X30NL10T20]
R31  10K  [RESC1609X55X30NL10T20]
R32  2k  [RESC1609X55X30NL10T20]
R33  12k  [RESC1609X55X30NL10T20]
R34  10K  [RESC1609X55X30NL10T20]
R35  10K  [RESC1609X55X30NL10T20]
U8  FT232HL-REEL  [FP-LQFP-48-MFG]
U9  93LC56B-I/MS  [MSOP-MS8_M]
U10  SG-9101CG 12.000MHZ C15PGAAA  [OSC-SMD_4P-L2.5-W2.0-BL_CTS_CA25]

### Ports
3V3, CDONE (out), CRESET_B (bidir), FTDI_SPI (harness FTDI_SPI), ICE_CLK (out), ICE_USB (harness ICE_USB)

### Harnesses
FTDI_SPI: FTDI_SS, FTDI_MOSI, FTDI_SCK, FTDI_MISO
ICE_USB: ICE_USB_N, ICE_USB_P

### Nets
FT_3V3: C34.1 C35.1 FB1.1 FB2.1 U8.39(VCCD)
FT_VCCIO: C36.1 C37.1 C38.1 R31.2 R34.2 R35.2 U8.12(VCCIO) U8.24(VCCIO) U8.46(VCCIO) U9.8(VCC)
FT_VPHY: C30.1 C31.1 FB1.2 U8.3(VPHY)
FT_VPLL: C32.1 C33.1 FB2.2 U8.8(VPLL)
FT_VREGIN: C28.1 C29.1 U8.40(VREGIN)
FTDI_3V3: R30.2 U10.1(OE/ST#) U10.4(VCC) ; port 3V3
GND: C25.2 C26.2 C27.2 C28.2 C29.2 C30.2 C31.2 C32.2 C33.2 C34.2 C35.2 C36.2 C37.2 C38.2 R33.2 U8.4(AGND) U8.9(AGND) U8.10(GND) U8.11(GND) U8.22(GND) U8.23(GND) U8.35(GND) U8.36(GND) U8.41(AGND) U8.42(TEST) U8.47(GND) U8.48(GND) U9.5(VSS) U10.2(GND)
CLK: R35.1 U8.44(EECLK) U9.2(CLK)
CS#: R34.1 U8.45(EECS) U9.1(CS)
DATA: R32.2 U8.43(EEDATA) U9.3(DI)
FTDI_MISO: U8.15(ADBUS2) ; port FTDI_SPI.FTDI_MISO
FTDI_MOSI: U8.14(ADBUS1) ; port FTDI_SPI.FTDI_MOSI
FTDI_SCK: U8.13(ADBUS0) ; port FTDI_SPI.FTDI_SCK
FTDI_SS: U8.16(ADBUS3) ; port FTDI_SPI.FTDI_SS
NetC25_1: C25.1 U8.37(VCCA)
NetC26_1: C26.1 U8.38(VCCCORE)
NetC27_1: C27.1 R30.1 U8.34(~{RESET})
NetR31_1: R31.1 R32.1 U9.4(DO)
NetR33_1: R33.1 U8.5(REF)
NetU8_1: U8.1(OSCI) U10.3(OUT) ; port ICE_CLK
NetU8_6: U8.6(DM) ; port ICE_USB.ICE_USB_N
NetU8_7: U8.7(DP) ; port ICE_USB.ICE_USB_P
NetU8_19: U8.19(ADBUS6) ; port CDONE
NetU8_20: U8.20(ADBUS7) ; port CRESET_B

Not connected (* = marked no-connect by the designer): U8 2(OSCO)* 17(ADBUS4)* 18(ADBUS5)* 21(ACBUS0)* 25(ACBUS1)* 26(ACBUS2)* 27(ACBUS3)* 28(ACBUS4)* 29(ACBUS5)* 30(ACBUS6)* 31(ACBUS7)* 32(ACBUS8)* 33(ACBUS9)*; U9 6(NC)* 7(NC)*

### Notes on the sheet
- Date:
- A4
- Project:
- Time:
- Sheet
- of
- Revision:
- File:
- Drawn By:

### Library data of the parts
C25 C26 C29 C31 C33 C35-C38 = CMP-001-00017-6: Chip Capacitor, 100 nF, +/- 10%, 50 V, 0603 (1608 Metric); Voltage Rating: 50V; Capacitor Type: Ceramic; Tolerance: 10%; Mounting Technology: SM; Max Operating Temperature: 125°C; RoHS Compliant: True; Pins: 2; Case/Package: 0603; Min Operating Temperature: -55°C
C27 = CMP-001-00004-6: Chip Capacitor, 1 uF, +/- 10%, 16 V, 0603 (1608 Metric); Capacitor Type: Ceramic; Mounting Technology: SM; RoHS Compliant: True; Min Operating Temperature: -55°C; Case/Package: 0603; Pins: 2; Voltage Rating: 16V; Max Operating Temperature: 125°C; Tolerance: 10%
C28 C30 C32 C34 = CMP-2006-02288-1: Part Number: C0603C475K9PAC7411; Manufacturer: Kemet
FB1 FB2 = CMP-08257-000171-1: Signal Line Ferrite Bead 600Ω  @ 100MHz 500mA DCR 400mΩ SMD 0603; Tolerance: 25%; DC Resistance (DCR): 400mR; REACH SVHC: No SVHC; RoHS Compliant: Yes; Case Code (Metric): 1608; Current Rating: 500mA; Package Quantity: 1; Width: 0.031inch; Number of Pins: 2; Case/Package: 0603; Case Code (Imperial): 0603; Packaging: Tape and Reel; Max DC Current: 500mA; Length: 0.063inch; Impedance: 600R; Mount: Surface Mount; Series: MMZ; Height: 0.037inch; Core Material: Ferrite
R30-R35 = CMP-2000-03692-1: as R1 on sheet 1_fpga
U8 = CMP-0078-00035-4: IC HS USB TO UART/FIFO 48LQFP; Interface: UART; Data Rate: 12Mbps; Number of Channels: 1; Operating Supply Voltage: 3.3V; Min Supply Voltage: 2.97V; Operating Supply Current: 24mA; Max Supply Voltage: 3.63V; Nominal Supply Current: 60mA; Width: 7mm; Height: 1.4mm; Weight: 0.006409oz; Min Operating Temperature: -40°C; Number of Pins: 48; Case/Package: LQFP; Lead Free: Lead Free; Package Quantity: 1; Packaging: Tape and Reel; Max Operating Temperature: 85°C; Length: 7mm; REACH SVHC: No SVHC; Mount: Surface Mount
U9 = CMP-0162-00478-1: 2K, 128x16-bit, 2.5V Microwire Serial EEPROM, 8-Pin MSOP, Industrial Temperature; PackageVersion: revBB, Aug-2009; PackageDescription: 8-Lead Plastic Micro Small Outline Package (MS) [MSOP]; DatasheetVersion: revF, May-2008; PackageReference: MSOP-MS8
U10 = SG-9101CG 12.000MHZ C15PGAAA: Operating Temperature:- Operating Temperature:-; Manufacturer: EPSON(爱普生); LCSC Part Name: 12MHz 1.62V~3.63V -40℃~+85℃; Supplier Part: C728996; Manufacturer Part: SG-9101CG 12.000MHz C15PGAAA; Supplier Footprint: SMD2520-4P; JLCPCB Part Class: Extended Part; Datasheet: https://item.szlcsc.com/datasheet/SG-9101CG%252012.000MHz%2520C15PGAAA/776678.html; Supplier: LCSC

## Sheet 6_FPGA_Flash.SchDoc
size A4; SheetNumber: 7; SheetTotal: 13
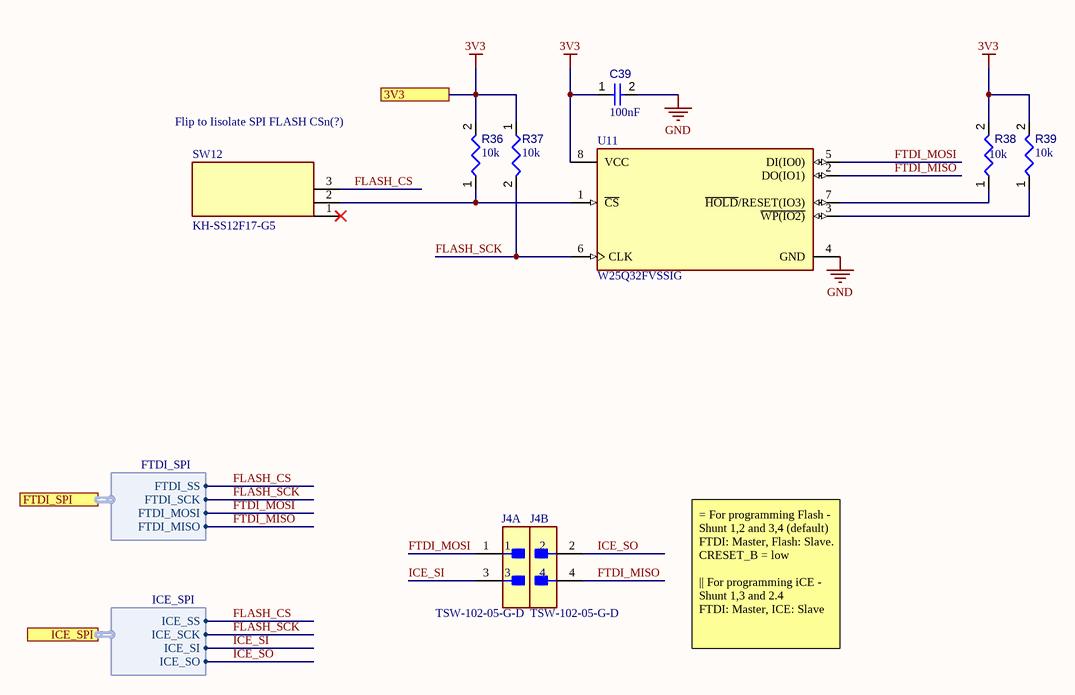
[diagram p5: 6_FPGA_Flash.SchDoc]

### Parts
C39  value 100nF  [CAPC1608X90X40NL10T20]  (hidden comment: Capacitor 100 nF +/-10% 50 V 0603)
J4  TSW-102-05-G-D  [FP-TSW-102-05-G-D-MFG]  (parts A,B of 2)
R36  value 10k  [RESC1608X55X25ML10T15]  (hidden comment: Resistor 10k +/-1% 0603 100 mW)
R37  value 10k  [RESC1608X55X25ML10T15]  (hidden comment: Resistor 10k +/-1% 0603 100 mW)
R38  value 10k  [RESC1608X55X25ML10T15]  (hidden comment: Resistor 10k +/-1% 0603 100 mW)
R39  value 10k  [RESC1608X55X25ML10T15]  (hidden comment: Resistor 10k +/-1% 0603 100 mW)
SW12  KH-SS12F17-G5  [SW-TH_KH-SS12F17-G5]
U11  W25Q32FVSSIG  [FP-SS-MFG]

### Ports
3V3, FTDI_SPI (harness FTDI_SPI), ICE_SPI (harness ICE_SPI)

### Harnesses
FTDI_SPI: FTDI_SS, FTDI_MOSI, FTDI_SCK, FTDI_MISO
ICE_SPI: ICE_SO, ICE_SI, ICE_SCK, ICE_SS

### Nets
3V3: C39.1 R36.2 R37.1 R38.2 R39.2 U11.8(VCC) ; port 3V3
GND: C39.2 U11.4(GND)
FLASH_CS: SW12.3 ; port FTDI_SPI.FTDI_SS, port ICE_SPI.ICE_SS
FLASH_SCK: R37.2 U11.6(CLK) ; port FTDI_SPI.FTDI_SCK, port ICE_SPI.ICE_SCK
FTDI_MISO: J4.4 U11.2(DO(IO1)) ; port FTDI_SPI.FTDI_MISO
FTDI_MOSI: J4.1 U11.5(DI(IO0)) ; port FTDI_SPI.FTDI_MOSI
ICE_SI: J4.3 ; port ICE_SPI.ICE_SI
ICE_SO: J4.2 ; port ICE_SPI.ICE_SO
NetR36_1: R36.1 SW12.2 U11.1(~{CS})
NetR38_1: R38.1 U11.7(~{HOLD}/RESET(IO3))
NetR39_1: R39.1 U11.3(~{WP(IO2)})

Not connected (* = marked no-connect by the designer): SW12 1*

### Notes on the sheet
- Flip to Iisolate SPI FLASH CSn(?)
- Date:
- A4
- Project:
- Time:
- Sheet
- of
- Revision:
- File:
- Drawn By:

### Library data of the parts
C39 = CMP-001-00017-6: as C25 on sheet 5_FTDI; Tolerance: 10%; Mounting Technology: SM; Max Operating Temperature: 125°C; RoHS Compliant: True; Pins: 2; Case/Package: 0603; Min Operating Temperature: -55°C
J4 = CMP-02766-001389-1: as J5 on sheet 1_fpga; Packaging: Bulk; Color: Black; Housing Material: Plastic; Contact Material: Bronze; Contact Plating: Gold; Housing Color: Black; Width: 5.08mm; Orientation: Straight; Pitch: 2.54mm; Lead Free: Lead Free; Series: TSW; Min Operating Temperature: -55°C; Contact Type: Male Pin; Height: 2.54mm; Termination: Solder; Number of Rows: 2; Contact Mating Length: 0.105inch; Package Quantity: 1; Length: 5.08mm; REACH SVHC: No SVHC; Mount: Through Hole; Radiation Hardening: No; Number of Contacts: 4; Max Operating Temperature: 125°C
R36-R39 = CMP-009-00017-5: Chip Resistor, 10 KOhm, +/- 1%, 01 W, -55 to 155 degC, 0603 (1608 Metric); Voltage Rating: 50V; Power: 100mW; RoHS Compliant: True; Min Operating Temperature: -55°C; Pins: 2; Case/Package: 0603; Mounting Technology: SM; Max Operating Temperature: 155°C; Tolerance: 1%
SW12 = KH-SS12F17-G5: Manufacturer: kinghelm(金航标); LCSC Part Name: 拨动开关 KH-SS12F17-G5; Supplier Part: C5274464; Manufacturer Part: KH-SS12F17-G5; Supplier Footprint: 插件; JLCPCB Part Class: Extended Part; Datasheet: https://atta.szlcsc.com/upload/public/pdf/source/20221118/A394A3D39A10FBA52FA26B90A9AAE8C2.pdf; Supplier: LCSC
U11 = CMP-2000-05006-2: IC FLASH 32M SPI 104MHZ 8SOIC; Manufacturer: Winbond; Obsolete Part: true; Access Time: 7ns; Nominal Supply Current: 8-20mA; Memory Size: 32Mbits; Max Supply Voltage: 3.6V; Min Supply Voltage: 2.7V; Standoff Height: 0.05mm; Interface: SPI,Other; Package: SS; Memory Type: FLASH; Ipc Land Pattern Name: SOIC127P790X195-8; Temperature Range High: +85°C; Temperature: -40°C to +85°C; Octopart: https://octopart.com/w25q32fvssig-winbond-23896462; Manufacturer Part Number: W25Q32FVSSIG; Ambient Temperature Range Low: -40°C; Lead Free: Yes; Height: 2.16mm; Automotive: No; Device Class L2: Memory; Digikey Description: IC FLASH 32M SPI 104MHZ 8SOIC; RoHS: TRUE; Frequency: 104MHz; Ambient Temperature Range High: +85°C; ComponentLink2Description: Datasheet; Category: IC; Device Class L1: Integrated Circuits (ICs); Device Class L3: Flash; Temperature Range Low: -40°C; Footprint Url: http://www.winbond.com/resource-files/an0000009%20spiflash%20pcb%20layout%20guideline%20v2.0%2009252017.pdf?__locale=en; ComponentLink2URL: https://www.winbond.com/resource-files/w25q32fv%20revj%2006032016.pdf

## Sheet 7_SD_slot.SchDoc
size A4; SheetNumber: 8; SheetTotal: 13
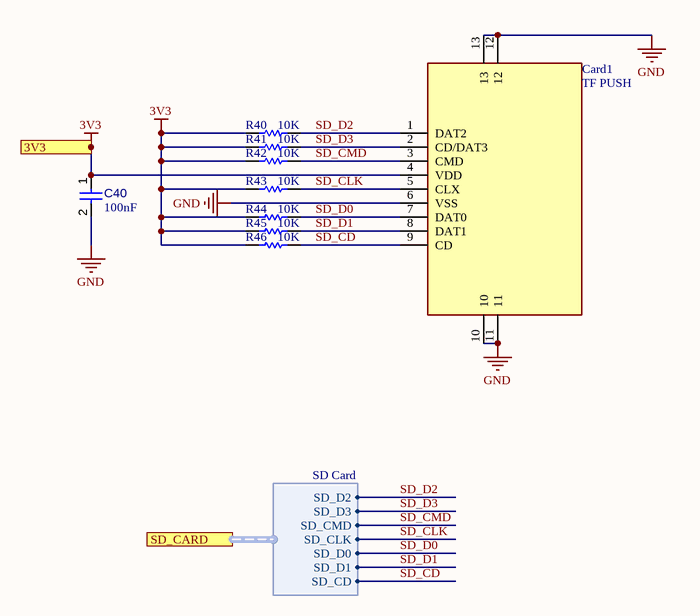
[diagram p6: 7_SD_slot.SchDoc]

### Parts
C40  value 100nF  [CAPC1608X90X40NL10T20]  (hidden comment: Capacitor 100 nF +/-10% 50 V 0603)
Card1  TF PUSH  [TF-SMD_TF-PUSH]
R40  10K  [RESC1609X55X30NL10T20]
R41  10K  [RESC1609X55X30NL10T20]
R42  10K  [RESC1609X55X30NL10T20]
R43  10K  [RESC1609X55X30NL10T20]
R44  10K  [RESC1609X55X30NL10T20]
R45  10K  [RESC1609X55X30NL10T20]
R46  10K  [RESC1609X55X30NL10T20]

### Ports
3V3, SD_CARD (harness SD Card)

### Harnesses
SD Card: SD_D2, SD_D3, SD_CMD, SD_CLK, SD_D0, SD_D1, SD_CD

### Nets
3V3: C40.1 Card1.4(VDD) R40.2 R41.2 R42.2 R43.2 R44.2 R45.2 R46.2 ; port 3V3
GND: C40.2 Card1.6(VSS) Card1.10 Card1.11 Card1.12 Card1.13
SD_CD: Card1.9(CD) R46.1 ; port SD_CARD.SD_CD
SD_CLK: Card1.5(CLX) R43.1 ; port SD_CARD.SD_CLK
SD_CMD: Card1.3(CMD) R42.1 ; port SD_CARD.SD_CMD
SD_D0: Card1.7(DAT0) R44.1 ; port SD_CARD.SD_D0
SD_D1: Card1.8(DAT1) R45.1 ; port SD_CARD.SD_D1
SD_D2: Card1.1(DAT2) R40.1 ; port SD_CARD.SD_D2
SD_D3: Card1.2(CD/DAT3) R41.1 ; port SD_CARD.SD_D3

### Notes on the sheet
- Date:
- A4
- Project:
- Time:
- Sheet
- of
- Revision:
- File:
- Drawn By:

### Library data of the parts
C40 = CMP-001-00017-6: as C25 on sheet 5_FTDI; Tolerance: 10%; Mounting Technology: SM; Max Operating Temperature: 125°C; RoHS Compliant: True; Pins: 2; Case/Package: 0603; Min Operating Temperature: -55°C
Card1 = CMP-019-000000-1: Card Connection Mode:Push-Push Card Type:MicroSD Card (TF Card) Connector Type:Connector and Ejector Additional Card Detection Pins:No Supplementary Features:- Height Above Board:2mm Operating Temperature:-25℃~+90℃ Operating Temperature:-25℃~+90℃; Manufacturer: SHOU HAN(首韩); Additional Card Detection Pins: No; Source: EasyEDA.schlib; LCSC Part Name: 9P，自弹式TF卡座; Card Connection Mode: Push-Push; Manufacturer Part: TF PUSH; JLCPCB Part Class: Extended Part; Operating Temperature: -25℃~+90℃; Datasheet: https://item.szlcsc.com/datasheet/TF%2520PUSH/372553.html; Design Item ID: TF PUSH; Supplier Part: C393941; Connector Type: Connector and Ejector; Height Above Board: 2mm; Supplier Footprint: SMD; Card Type: MicroSD Card (TF Card)
R40-R46 = CMP-2000-03692-1: as R1 on sheet 1_fpga

## Sheet 8_Lights.SchDoc
size A4; SheetNumber: 9; SheetTotal: 13
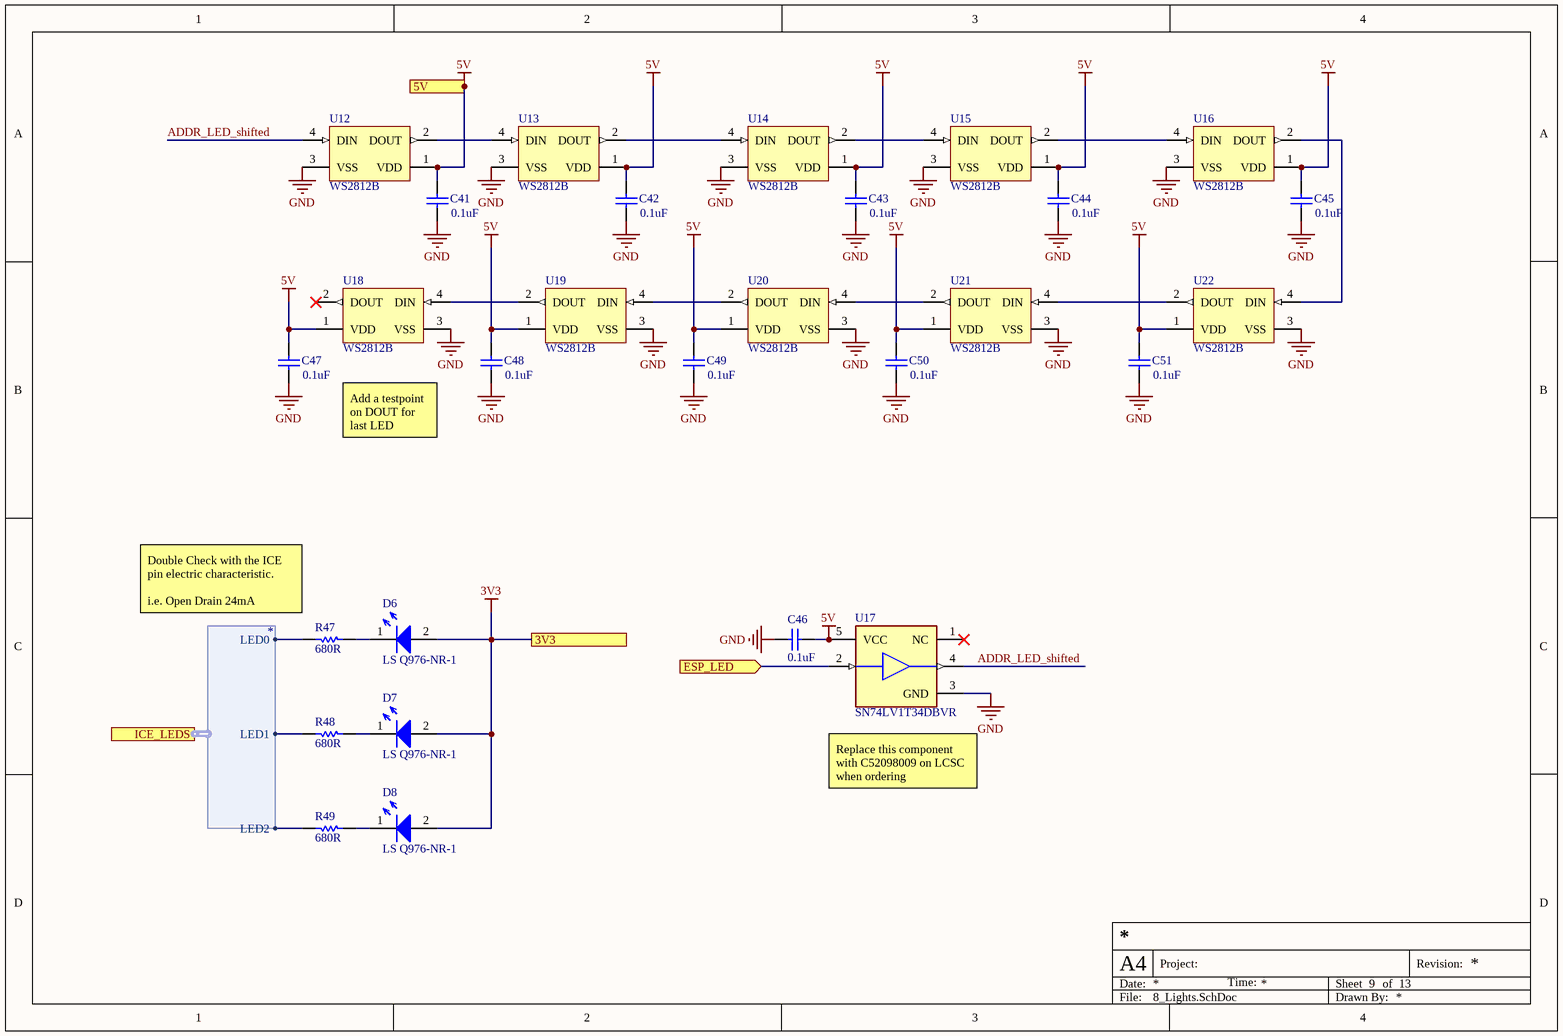
[diagram p7: 8_Lights.SchDoc]

### Parts
C41  0.1uF  [CAPC1609X100X15NL20]
C42  0.1uF  [CAPC1609X100X15NL20]
C43  0.1uF  [CAPC1609X100X15NL20]
C44  0.1uF  [CAPC1609X100X15NL20]
C45  0.1uF  [CAPC1609X100X15NL20]
C46  0.1uF  [CAPC1609X100X15NL20]
C47  0.1uF  [CAPC1609X100X15NL20]
C48  0.1uF  [CAPC1609X100X15NL20]
C49  0.1uF  [CAPC1609X100X15NL20]
C50  0.1uF  [CAPC1609X100X15NL20]
C51  0.1uF  [CAPC1609X100X15NL20]
D6  LS Q976-NR-1  [LED0603]
D7  LS Q976-NR-1  [LED0603]
D8  LS Q976-NR-1  [LED0603]
R47  680R  [RESC1609X55X30NL10T20]
R48  680R  [RESC1609X55X30NL10T20]
R49  680R  [RESC1609X55X30NL10T20]
U12  WS2812B  [ADAI-WS2812B_V]
U13  WS2812B  [ADAI-WS2812B_V]
U14  WS2812B  [ADAI-WS2812B_V]
U15  WS2812B  [ADAI-WS2812B_V]
U16  WS2812B  [ADAI-WS2812B_V]
U17  SN74LV1T34DBVR  [FP-DBV0005A-IPC_B]
U18  WS2812B  [ADAI-WS2812B_V]
U19  WS2812B  [ADAI-WS2812B_V]
U20  WS2812B  [ADAI-WS2812B_V]
U21  WS2812B  [ADAI-WS2812B_V]
U22  WS2812B  [ADAI-WS2812B_V]

### Ports
3V3, 5V, ESP_LED (in), ICE_LEDS (harness *)

### Harnesses
*: LED2, LED0, LED1

### Nets
3V3: D6.2(Anode) D7.2(Anode) D8.2(Anode) ; port 3V3
5V: C41.2 C42.2 C43.2 C44.2 C45.2 C46.1 C47.2 C48.2 C49.2 C50.2 C51.2 U12.1(VDD) U13.1(VDD) U14.1(VDD) U15.1(VDD) U16.1(VDD) U17.5(VCC) U18.1(VDD) U19.1(VDD) U20.1(VDD) U21.1(VDD) U22.1(VDD) ; port 5V
GND: C41.1 C42.1 C43.1 C44.1 C45.1 C46.2 C47.1 C48.1 C49.1 C50.1 C51.1 U12.3(VSS) U13.3(VSS) U14.3(VSS) U15.3(VSS) U16.3(VSS) U17.3(GND) U18.3(VSS) U19.3(VSS) U20.3(VSS) U21.3(VSS) U22.3(VSS)
ADDR_LED_shifted: U12.4(DIN) U17.4(Y)
NetD6_1: D6.1(Cathode) R47.1
NetD7_1: D7.1(Cathode) R48.1
NetD8_1: D8.1(Cathode) R49.1
NetR47_2: R47.2 ; port ICE_LEDS.LED0
NetR48_2: R48.2 ; port ICE_LEDS.LED1
NetR49_2: R49.2 ; port ICE_LEDS.LED2
NetU12_2: U12.2(DOUT) U13.4(DIN)
NetU13_2: U13.2(DOUT) U14.4(DIN)
NetU14_2: U14.2(DOUT) U15.4(DIN)
NetU15_2: U15.2(DOUT) U16.4(DIN)
NetU16_2: U16.2(DOUT) U22.4(DIN)
NetU17_2: U17.2(A) ; port ESP_LED
NetU18_4: U18.4(DIN) U19.2(DOUT)
NetU19_4: U19.4(DIN) U20.2(DOUT)
NetU20_4: U20.4(DIN) U21.2(DOUT)
NetU21_4: U21.4(DIN) U22.2(DOUT)

Not connected (* = marked no-connect by the designer): U17 1(NC)*; U18 2(DOUT)*

### Notes on the sheet
- Add a testpoint on DOUT for last LED
- (near R47) Double Check with the ICE pin electric characteristic.
  i.e. Open Drain 24mA
- (near U17) Replace this component with C52098009 on LCSC when ordering
- Date:
- A4
- Project:
- Time:
- Sheet
- of
- Revision:
- File:
- Drawn By:

### Library data of the parts
C41-C51 = CMP-2006-00183-1: as C1 on sheet 1_fpga
D6-D8 = CMP-029-000016-3: LED RED DIFFUSED 0603 SMD; Manufacturer: OSRAM Opto Semiconductors Inc.; Voltage - Forward Max: 2V; Current - Average: 20mA; Supplier 1: Digi-Key; Package: 0603 (1608 Metric); Type: LED; Supplier Part Number 1: 475-2512-1-ND; ComponentLink1Description: Datasheet; Color: Red; ComponentLink1URL: https://dammedia.osram.info/media/resource/hires/osram-dam-2493499/LS%20Q976.pdf; PN: LS Q976-NR-1
R47-R49 = CMP-2000-03692-1: as R1 on sheet 1_fpga
U12-U16 U18-U22 = CMP-007-00035-2: Intelligent Control LED Integrated Light Source, 3.5 to 5.3 V, -25 to 80 degC, 4-Pin SMD, RoHS, Bulk; Manufacturer: Adafruit Industries; Datasheet URL: https://cdn-shop.adafruit.com/datasheets/WS2812B.pdf; Manufacturer URL: https://www.adafruit.com/; Datasheet Version: May-13; Case/Package: WS2812B; Mounting Technology: SM; RoHS Compliant: False; Package Description: 4-Pin Surface Mount Device, Body 5 x 5 mm, Pitch 3.3 mm; Package Reference: WS2812B
U17 = CMP-0859-00123-4: IC BUF NON-INVERT 5.5V SOT23-5; Low Level Output Current: 8mA; Polarity: Non-Inverting; Number of Channels: 1; Propagation Delay: 15.5ns; High Level Output Current: -8mA; Quiescent Current: 1uA; Logic Function: Buffer; Min Supply Voltage: 1.6V; Min Operating Temperature: -40°C; Package Quantity: 3000; Max Operating Temperature: 125°C; Operating Supply Current: 8mA; Radiation Hardening: No; REACH SVHC: No SVHC; Number of Bits per Element: 1; Mount: Surface Mount; Number of Outputs: 1; Lead Free: Lead Free; Number of Pins: 5; Weight: 0.000353oz; Number of Output Lines: 1; Number of Elements: 1; Number of Input Lines: 1; Number of Bits: 1; Case/Package: SOT-23-5; Packaging: Tape and Reel; Max Supply Voltage: 5.5V; Number of Inputs: 1